# EAGLE design module_bga (EAGLE 9.3.0)

## Sheet 1 of 5
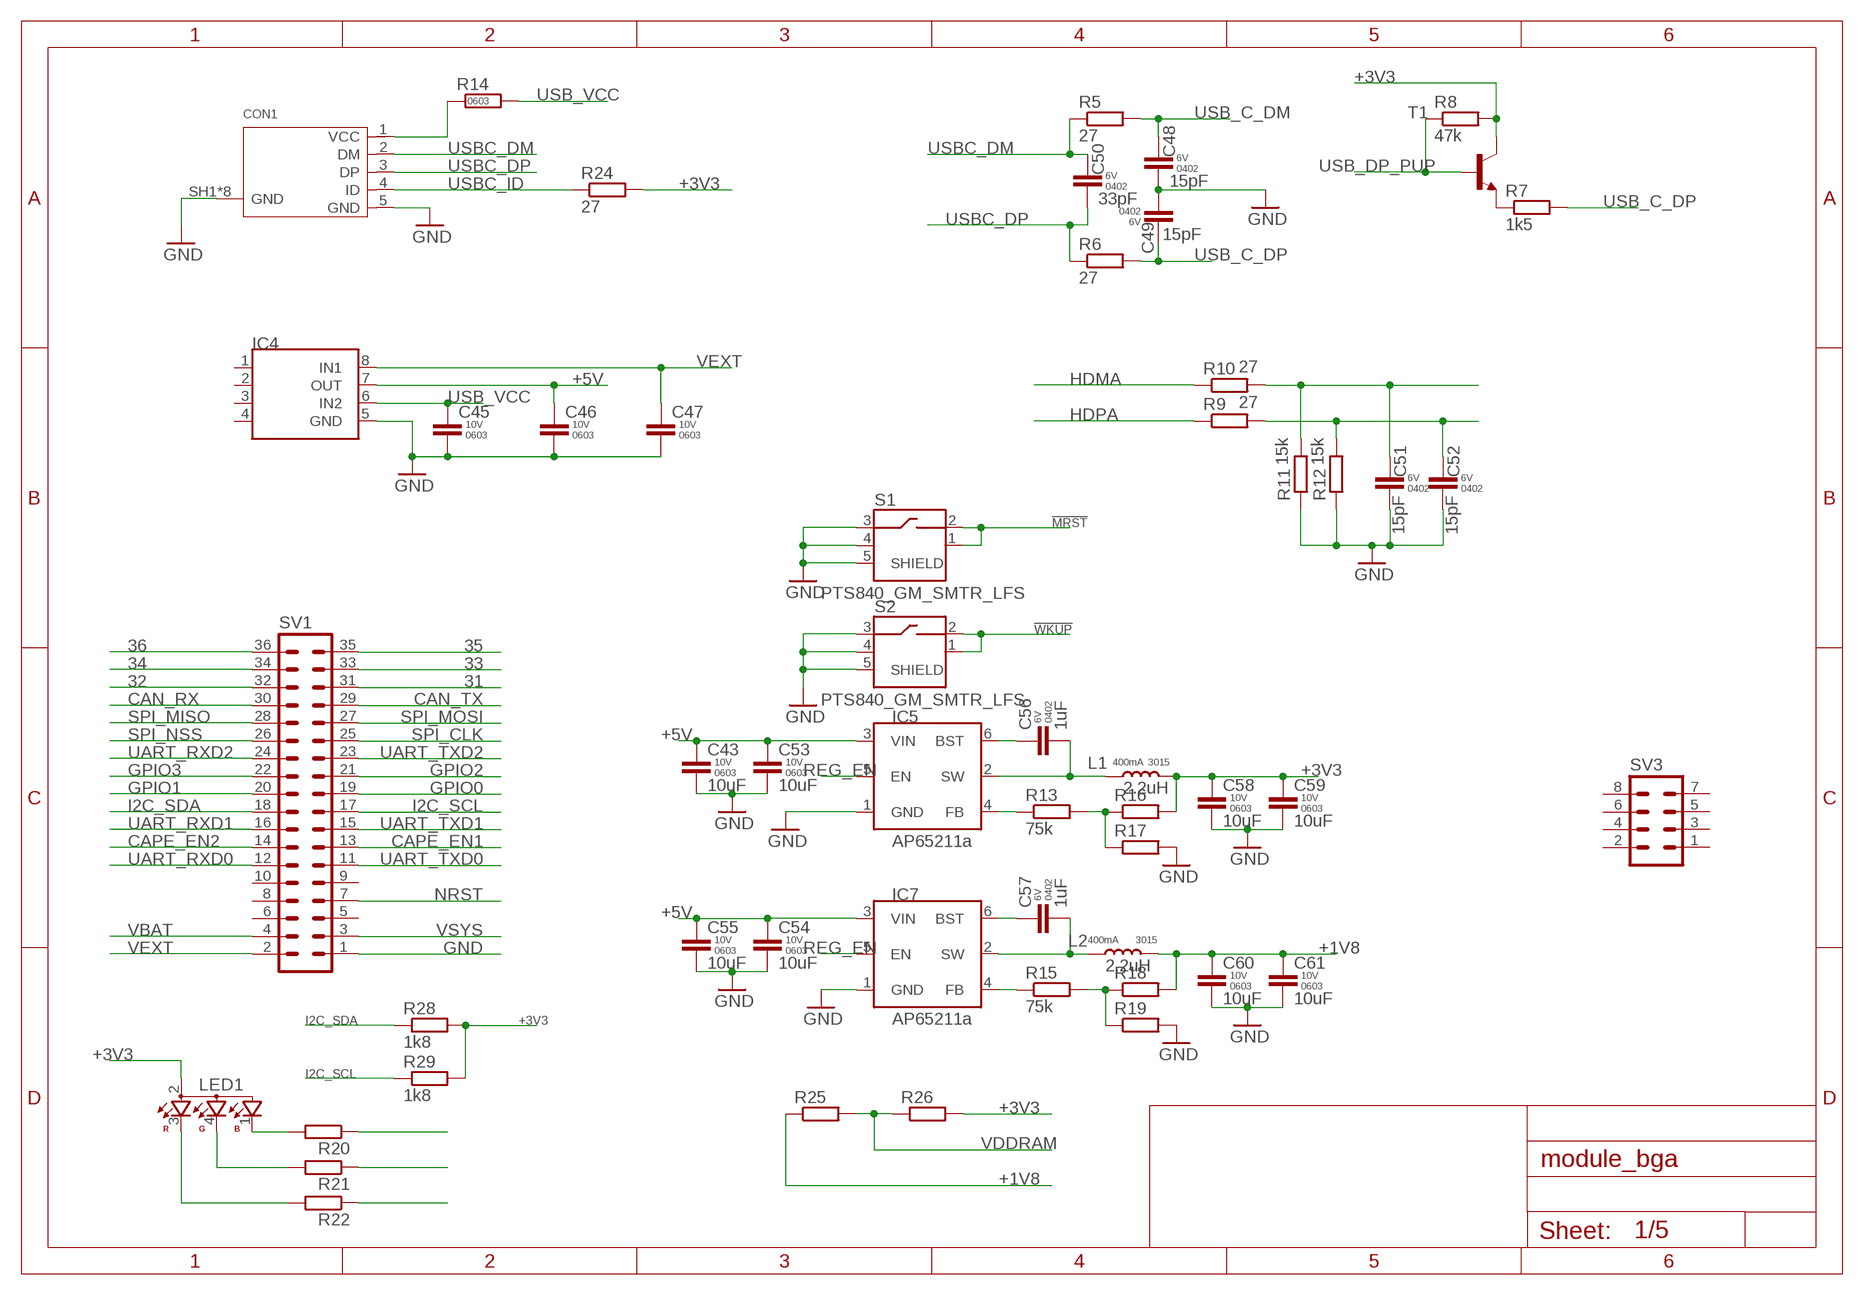
[diagram p0: schematic, sheet 1]

### Parts
C43  10uF  CAP-0603  [C0603]
C45  CAP-0603  [C0603]
C46  CAP-0603  [C0603]
C47  CAP-0603  [C0603]
C48  15pF  CAP-0402  [C0402K]
C49  15pF  CAP-0402  [C0402K]
C50  33pF  CAP-0402  [C0402K]
C51  15pF  CAP-0402  [C0402K]
C52  15pF  CAP-0402  [C0402K]
C53  10uF  CAP-0603  [C0603]
C54  10uF  CAP-0603  [C0603]
C55  10uF  CAP-0603  [C0603]
C56  1uF  CAP-0402  [C0402K]
C57  1uF  CAP-0402  [C0402K]
C58  10uF  CAP-0603  [C0603]
C59  10uF  CAP-0603  [C0603]
C60  10uF  CAP-0603  [C0603]
C61  10uF  CAP-0603  [C0603]
CON1  10118194-0001LF  [10118194]
IC4  TPS2115A  [TSSOP8]
IC5  AP65211  [SOT95P280X110-6]
IC7  AP65211  [SOT95P280X110-6]
L1  2.2uH  DJNR3015  [L3230M]
L2  2.2uH  DJNR3015  [L3230M]
LED1  OSTB1204C1E  [321015RGB]
R5  27  R-EU_R0402  [R0402]
R6  27  R-EU_R0402  [R0402]
R7  1k5  R-EU_R0402  [R0402]
R8  47k  R-EU_R0402  [R0402]
R9  27  R-EU_R0402  [R0402]
R10  27  R-EU_R0402  [R0402]
R11  15k  R-EU_R0402  [R0402]
R12  15k  R-EU_R0402  [R0402]
R13  75k  R-EU_R0402  [R0402]
R14  RES-0603  [R0603]
R15  75k  R-EU_R0402  [R0402]
R16  R-EU_R0402  [R0402]
R17  R-EU_R0402  [R0402]
R18  R-EU_R0402  [R0402]
R19  R-EU_R0402  [R0402]
R20  R-EU_R0402  [R0402]
R21  R-EU_R0402  [R0402]
R22  R-EU_R0402  [R0402]
R24  27  R-EU_R0402  [R0402]
R25  R-EU_R0603  [R0603]
R26  R-EU_R0603  [R0603]
R28  1k8  R-EU_R0402  [R0402]
R29  1k8  R-EU_R0402  [R0402]
S1  PTS840_GM_SMTR_LFS  [SW_PTS840GMSMTRLFS]
S2  PTS840_GM_SMTR_LFS  [SW_PTS840GMSMTRLFS]
SV1  MA18-2  [MA18-2]
SV3  MA04-2  [MA04-2]
T1  MMBT2222ALT1-NPN-SOT23-BEC  [SOT23-BEC]

### Nets
31: SV1.31
32: SV1.32
33: SV1.33
34: SV1.34
35: SV1.35
36: SV1.36
!MRST: S1.1 S1.2 ; also sheet 2
!WKUP: S2.1 S2.2 ; also sheet 2
+1V8: C60.1 C61.1 L2.2 R18.2 R25.1 ; also sheet 2
+3V3: C58.1 C59.1 L1.2 LED1.2 R8.2 R16.2 R24.2 R26.2 R28.2 R29.2 T1.C ; also sheet 2,5
+5V: C43.1 C46.1 C53.1 C54.1 C55.1 IC4.7(OUT) IC5.3(VIN) IC7.3(VIN)
CAN_RX: SV1.30
CAN_TX: SV1.29
CAPE_EN1: SV1.13
CAPE_EN2: SV1.14
GND: C43.2 C45.2 C46.2 C47.2 C48.2 C49.2 C51.2 C52.2 C53.2 C54.2 C55.2 C58.2 C59.2 C60.2 C61.2 CON1.5(GND) CON1.SH1(GND) CON1.SH2(GND) CON1.SH3(GND) CON1.SH4(GND) CON1.SH5(GND) CON1.SH6(GND) CON1.SH7(GND) CON1.SH8(GND) IC4.5(GND) IC5.1(GND) IC7.1(GND) R11.1 R12.1 R17.2 R19.2 S1.3 S1.4 S1.5(SHIELD) S2.3 S2.4 S2.5(SHIELD) SV1.1 ; also sheet 2,3,5
GPIO0: SV1.19
GPIO1: SV1.20
GPIO2: SV1.21
GPIO3: SV1.22
HDMA: R10.1 ; also sheet 2
HDPA: R9.1 ; also sheet 2
I2C_SCL: R29.1 SV1.17 ; also sheet 2
I2C_SDA: R28.1 SV1.18 ; also sheet 2
N$3: C56.2 IC5.2(SW) L1.1
N$4: CON1.1(VCC) R14.1
N$6: R20.1
N$8: C57.2 IC7.2(SW) L2.1
N$9: LED1.1 R20.2
N$10: C56.1 IC5.6(BST)
N$11: C57.1 IC7.6(BST)
N$13: C52.1 R9.2 R12.2
N$14: LED1.4 R21.2
N$15: IC7.4(FB) R15.1
N$18: R7.1 T1.E
N$19: C51.1 R10.2 R11.2
N$20: IC5.4(FB) R13.1
N$21: R15.2 R18.1 R19.1
N$22: R13.2 R16.1 R17.1
N$23: LED1.3 R22.2
N$24: R21.1
N$25: R22.1
NRST: SV1.7 ; also sheet 2
REG_EN: IC5.5(EN) IC7.5(EN)
SPI_CLK: SV1.25 ; also sheet 2
SPI_MISO: SV1.28 ; also sheet 2
SPI_MOSI: SV1.27 ; also sheet 2
SPI_NSS: SV1.26
UART_RXD0: SV1.12 ; also sheet 2
UART_RXD1: SV1.16 ; also sheet 2
UART_RXD2: SV1.24 ; also sheet 2
UART_TXD0: SV1.11 ; also sheet 2
UART_TXD1: SV1.15 ; also sheet 2
UART_TXD2: SV1.23 ; also sheet 2
USB_C_DM: C48.1 R5.2 ; also sheet 2
USB_C_DP: C49.1 R6.2 R7.2 ; also sheet 2
USB_DP_PUP: R8.1 T1.B
USB_VCC: C45.1 IC4.6(IN2) R14.2
USBC_DM: C50.1 CON1.2(DM) R5.1
USBC_DP: C50.2 CON1.3(DP) R6.1
USBC_ID: CON1.4(ID) R24.1
VBAT: SV1.4
VDDRAM: R25.2 R26.1 ; also sheet 2,3
VEXT: C47.1 IC4.8(IN1) SV1.2
VSYS: SV1.3
Unconnected: IC4.1 IC4.2 IC4.3 IC4.4 SV1.5 SV1.6 SV1.8 SV1.9 SV1.10 SV3.1 SV3.2 SV3.3 SV3.4 SV3.5 SV3.6 SV3.7 SV3.8

## Sheet 2 of 5
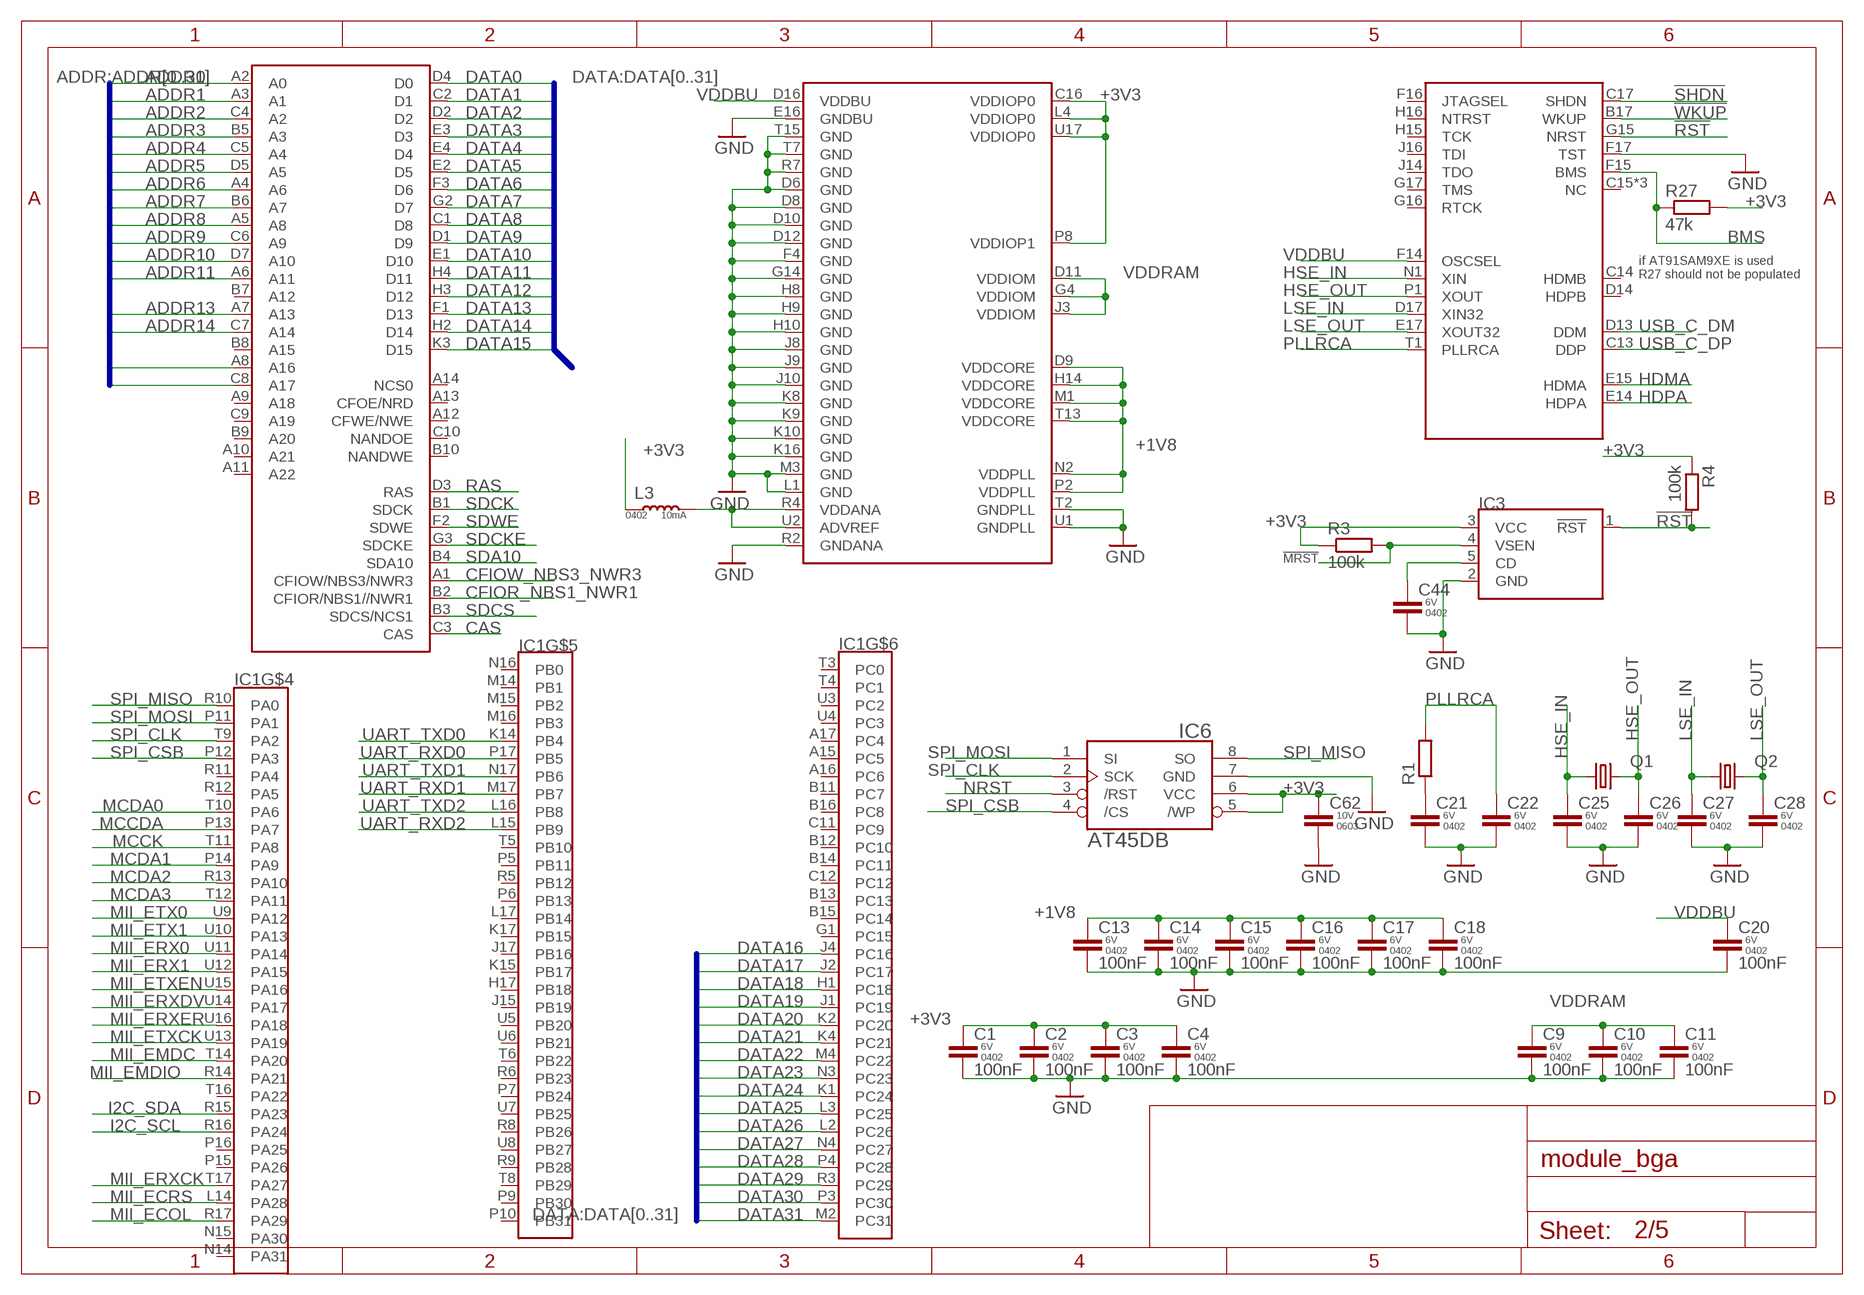
[diagram p1: schematic, sheet 2]

### Parts
C1  100nF  CAP-0402  [C0402K]
C2  100nF  CAP-0402  [C0402K]
C3  100nF  CAP-0402  [C0402K]
C4  100nF  CAP-0402  [C0402K]
C9  100nF  CAP-0402  [C0402K]
C10  100nF  CAP-0402  [C0402K]
C11  100nF  CAP-0402  [C0402K]
C13  100nF  CAP-0402  [C0402K]
C14  100nF  CAP-0402  [C0402K]
C15  100nF  CAP-0402  [C0402K]
C16  100nF  CAP-0402  [C0402K]
C17  100nF  CAP-0402  [C0402K]
C18  100nF  CAP-0402  [C0402K]
C20  100nF  CAP-0402  [C0402K]
C21  CAP-0402  [C0402K]
C22  CAP-0402  [C0402K]
C25  CAP-0402  [C0402K]
C26  CAP-0402  [C0402K]
C27  CAP-0402  [C0402K]
C28  CAP-0402  [C0402K]
C44  CAP-0402  [C0402K]
C62  CAP-0603  [C0603]
IC1  AT91SAM9260-BGA  [BGA289C80P17X17_1500X1500X100]
IC3  STM1831  [SOT95P280X100-5]
IC6  AT45DB-S  [SOIC8_208MIL]
L3  IND-0402  [L0402]
Q1  3215-7  [3215]
Q2  CFPX–217-NHT  [3215]
R1  R-EU_R0402  [R0402]
R3  100k  R-EU_R0402  [R0402]
R4  100k  R-EU_R0402  [R0402]
R27  47k  R-EU_R0402  [R0402]

### Nets
!MRST: IC3.4(VSEN) R3.2 ; also sheet 1
!RST: IC1.G15(NRST) IC3.1(!RST) R4.2
!SHDN: IC1.C17(SHDN)
!WKUP: IC1.B17(WKUP) ; also sheet 1
+1V8: C13.1 C14.1 C15.1 C16.1 C17.1 C18.1 IC1.D9(VDDCORE) IC1.H14(VDDCORE) IC1.M1(VDDCORE) IC1.N2(VDDPLL) IC1.P2(VDDPLL) IC1.T13(VDDCORE) ; also sheet 1
+3V3: C1.1 C2.1 C3.1 C4.1 C62.1 IC1.C16(VDDIOP0) IC1.L4(VDDIOP0) IC1.P8(VDDIOP1) IC1.U17(VDDIOP0) IC3.3(VCC) IC6.5(/WP) IC6.6(VCC) L3.1 R3.1 R4.1 R27.2 ; also sheet 1,5
ADDR0: IC1.A2(A0) ; also sheet 3
ADDR1: IC1.A3(A1) ; also sheet 3
ADDR2: IC1.C4(A2) ; also sheet 3
ADDR3: IC1.B5(A3) ; also sheet 3
ADDR4: IC1.C5(A4) ; also sheet 3
ADDR5: IC1.D5(A5) ; also sheet 3
ADDR6: IC1.A4(A6) ; also sheet 3
ADDR7: IC1.B6(A7) ; also sheet 3
ADDR8: IC1.A5(A8) ; also sheet 3
ADDR9: IC1.C6(A9) ; also sheet 3
ADDR10: IC1.D7(A10) ; also sheet 3
ADDR11: IC1.A6(A11) ; also sheet 3
ADDR13: IC1.A7(A13) ; also sheet 3
ADDR14: IC1.C7(A14) ; also sheet 3
ADDR16: IC1.A8(A16) ; also sheet 3
ADDR17: IC1.C8(A17) ; also sheet 3
BMS: IC1.F15(BMS) R27.1
CAS: IC1.C3(CAS) ; also sheet 3
CFIOR_NBS1_NWR1: IC1.B2(CFIOR/NBS1//NWR1) ; also sheet 3
CFIOW_NBS3_NWR3: IC1.A1(CFIOW/NBS3/NWR3) ; also sheet 3
DATA0: IC1.D4(D0) ; also sheet 3
DATA1: IC1.C2(D1) ; also sheet 3
DATA2: IC1.D2 ; also sheet 3
DATA3: IC1.E3(D3) ; also sheet 3
DATA4: IC1.E4(D4) ; also sheet 3
DATA5: IC1.E2(D5) ; also sheet 3
DATA6: IC1.F3(D6) ; also sheet 3
DATA7: IC1.G2(D7) ; also sheet 3
DATA8: IC1.C1(D8) ; also sheet 3
DATA9: IC1.D1(D9) ; also sheet 3
DATA10: IC1.E1(D10) ; also sheet 3
DATA11: IC1.H4(D11) ; also sheet 3
DATA12: IC1.H3(D12) ; also sheet 3
DATA13: IC1.F1(D13) ; also sheet 3
DATA14: IC1.H2(D14) ; also sheet 3
DATA15: IC1.K3(D15) ; also sheet 3
DATA16: IC1.J4(PC16) ; also sheet 3
DATA17: IC1.J2(PC17) ; also sheet 3
DATA18: IC1.H1(PC18) ; also sheet 3
DATA19: IC1.J1(PC19) ; also sheet 3
DATA20: IC1.K2(PC20) ; also sheet 3
DATA21: IC1.K4(PC21) ; also sheet 3
DATA22: IC1.M4(PC22) ; also sheet 3
DATA23: IC1.N3(PC23) ; also sheet 3
DATA24: IC1.K1(PC24) ; also sheet 3
DATA25: IC1.L3(PC25) ; also sheet 3
DATA26: IC1.L2(PC26) ; also sheet 3
DATA27: IC1.N4(PC27) ; also sheet 3
DATA28: IC1.P4(PC28) ; also sheet 3
DATA29: IC1.R3(PC29) ; also sheet 3
DATA30: IC1.P3(PC30) ; also sheet 3
DATA31: IC1.M2(PC31) ; also sheet 3
GND: C1.2 C2.2 C3.2 C4.2 C9.2 C10.2 C11.2 C13.2 C14.2 C15.2 C16.2 C17.2 C18.2 C20.2 C21.2 C22.2 C25.2 C26.2 C27.2 C28.2 C44.2 C62.2 IC1.D6(GND) IC1.D8(GND) IC1.D10(GND) IC1.D12(GND) IC1.E16(GNDBU) IC1.F4(GND) IC1.F17(TST) IC1.G14(GND) IC1.H8(GND) IC1.H9(GND) IC1.H10(GND) IC1.J8(GND) IC1.J9(GND) IC1.J10(GND) IC1.K8(GND) IC1.K9(GND) IC1.K10(GND) IC1.K16(GND) IC1.L1(GND) IC1.M3(GND) IC1.R2(GNDANA) IC1.R7(GND) IC1.T2(GNDPLL) IC1.T7(GND) IC1.T15(GND) IC1.U1(GNDPLL) IC3.2(GND) IC6.7(GND) ; also sheet 1,3,5
HDMA: IC1.E15(HDMA) ; also sheet 1
HDPA: IC1.E14(HDPA) ; also sheet 1
HSE_IN: C25.1 IC1.N1(XIN) Q1.1
HSE_OUT: C26.1 IC1.P1(XOUT) Q1.3
I2C_SCL: IC1.R16(PA24) ; also sheet 1
I2C_SDA: IC1.R15(PA23) ; also sheet 1
LSE_IN: C27.1 IC1.D17(XIN32) Q2.1
LSE_OUT: C28.1 IC1.E17(XOUT32) Q2.2
MCCDA: IC1.P13(PA7) ; also sheet 5
MCCK: IC1.T11(PA8) ; also sheet 5
MCDA0: IC1.T10(PA6) ; also sheet 5
MCDA1: IC1.P14(PA9) ; also sheet 5
MCDA2: IC1.R13(PA10) ; also sheet 5
MCDA3: IC1.T12(PA11) ; also sheet 5
MII_ECOL: IC1.R17(PA29)
MII_ECRS: IC1.L14(PA28)
MII_EMDC: IC1.T14(PA20)
MII_EMDIO: IC1.R14(PA21)
MII_ERX0: IC1.U11(PA14)
MII_ERX1: IC1.U12(PA15)
MII_ERXCK: IC1.T17(PA27)
MII_ERXDV: IC1.U14(PA17)
MII_ERXER: IC1.U16(PA18)
MII_ETX0: IC1.U9(PA12)
MII_ETX1: IC1.U10(PA13)
MII_ETXCK: IC1.U13(PA19)
MII_ETXEN: IC1.U15(PA16)
N$1: C21.1 R1.1
N$17: C44.1 IC3.5(CD)
N$28: IC1.R4(VDDANA) IC1.U2(ADVREF) L3.2
NRST: IC6.3(/RST) ; also sheet 1
PLLRCA: C22.1 IC1.T1(PLLRCA) R1.2
RAS: IC1.D3(RAS) ; also sheet 3
SDA10: IC1.B4(SDA10) ; also sheet 3
SDCK: IC1.B1(SDCK) ; also sheet 3
SDCKE: IC1.G3(SDCKE) ; also sheet 3
SDCS: IC1.B3(SDCS/NCS1) ; also sheet 3
SDWE: IC1.F2(SDWE) ; also sheet 3
SPI_CLK: IC1.T9(PA2) IC6.2(SCK) ; also sheet 1
SPI_CSB: IC1.P12(PA3) IC6.4(/CS)
SPI_MISO: IC1.R10(PA0) IC6.8(SO) ; also sheet 1
SPI_MOSI: IC1.P11(PA1) IC6.1(SI) ; also sheet 1
UART_RXD0: IC1.P17(PB5) ; also sheet 1
UART_RXD1: IC1.M17(PB7) ; also sheet 1
UART_RXD2: IC1.L15(PB9) ; also sheet 1
UART_TXD0: IC1.K14(PB4) ; also sheet 1
UART_TXD1: IC1.N17(PB6) ; also sheet 1
UART_TXD2: IC1.L16(PB8) ; also sheet 1
USB_C_DM: IC1.D13(DDM) ; also sheet 1
USB_C_DP: IC1.C13(DDP) ; also sheet 1
VDDBU: C20.1 IC1.D16(VDDBU) IC1.F14(OSCSEL)
VDDRAM: C9.1 C10.1 C11.1 IC1.D11(VDDIOM) IC1.G4(VDDIOM) IC1.J3(VDDIOM) ; also sheet 1,3
Unconnected: IC1.A9(A18) IC1.A10(A21) IC1.A11(A22) IC1.A12(CFWE/NWE) IC1.A13(CFOE/NRD) IC1.A14(NCS0) IC1.A15(PC5) IC1.A16(PC6) IC1.A17(PC4) IC1.B7(A12) IC1.B8(A15) IC1.B9(A20) IC1.B10(NANDWE) IC1.B11(PC7) IC1.B12(PC10) IC1.B13(PC13) IC1.B14(PC11) IC1.B15(PC14) IC1.B16(PC8) IC1.C9(A19) IC1.C10(NANDOE) IC1.C11(PC9) IC1.C12 IC1.C14(HDMB) IC1.C15(NC) IC1.D14(HDPB) IC1.D15(NC) IC1.F16(JTAGSEL) IC1.G1(PC15) IC1.G16(RTCK) IC1.G17(TMS) IC1.H15(TCK) IC1.H16(NTRST) IC1.H17(PB18) IC1.J14(TDO) IC1.J15(PB19) IC1.J16(TDI) IC1.J17(PB16) IC1.K15(PB17) IC1.K17(PB15) IC1.L17(PB14) IC1.M14(PB1) IC1.M15(PB2) IC1.M16(PB3) IC1.N14(PA31) IC1.N15(PA30) IC1.N16(PB0) IC1.P5(PB11) IC1.P6(PB13) IC1.P7(PB24) IC1.P9(PB30) IC1.P10(PB31) IC1.P15(PA26) IC1.P16(PA25) IC1.R1(NC) IC1.R5(PB12) IC1.R6(PB23) IC1.R8(PB26) IC1.R9(PB28) IC1.R11(PA4) IC1.R12(PA5) IC1.T3(PC0) IC1.T4(PC1) IC1.T5(PB10) IC1.T6(PB22) IC1.T8(PB29) IC1.T16(PA22) IC1.U3(PC2) IC1.U4(PC3) IC1.U5(PB20) IC1.U6(PB21) IC1.U7(PB25) IC1.U8(PB27)

### Buses
ADDR:ADDR[0..31]
DATA:DATA[0..31]

### Notes on the sheet
- if AT91SAM9XE is used 
  R27 should not be populated

## Sheet 3 of 5: SDRAM
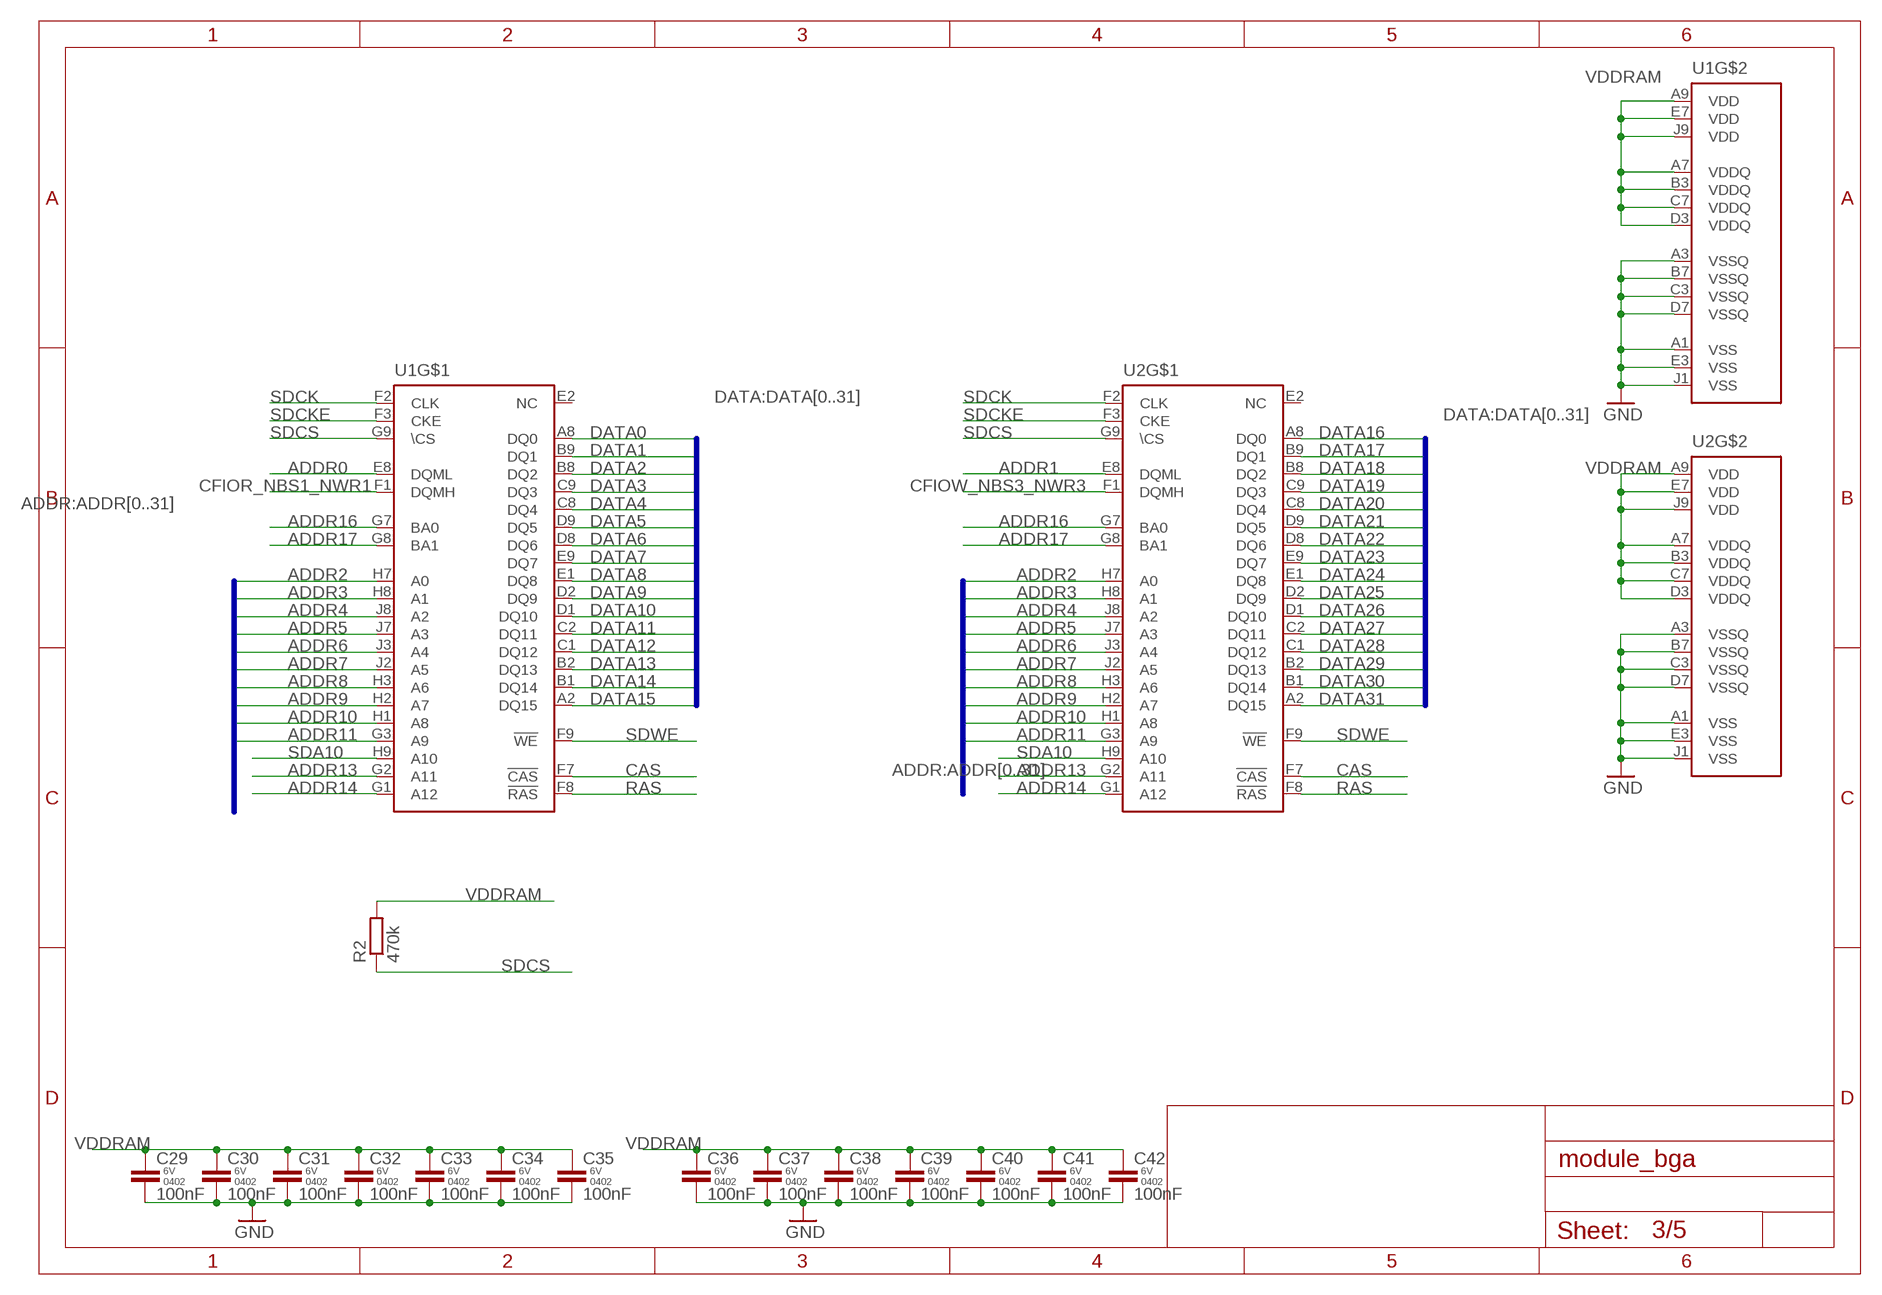
[diagram p2: schematic, sheet 3]

### Parts
C29  100nF  CAP-0402  [C0402K]
C30  100nF  CAP-0402  [C0402K]
C31  100nF  CAP-0402  [C0402K]
C32  100nF  CAP-0402  [C0402K]
C33  100nF  CAP-0402  [C0402K]
C34  100nF  CAP-0402  [C0402K]
C35  100nF  CAP-0402  [C0402K]
C36  100nF  CAP-0402  [C0402K]
C37  100nF  CAP-0402  [C0402K]
C38  100nF  CAP-0402  [C0402K]
C39  100nF  CAP-0402  [C0402K]
C40  100nF  CAP-0402  [C0402K]
C41  100nF  CAP-0402  [C0402K]
C42  100nF  CAP-0402  [C0402K]
R2  470k  R-EU_R0402  [R0402]
U1  IS42S16160G  [BGA81C80P9X9_800X800X120]
U2  IS42S16160G  [BGA81C80P9X9_800X800X120]

### Nets
ADDR0: U1.E8(DQML) ; also sheet 2
ADDR1: U2.E8(DQML) ; also sheet 2
ADDR2: U1.H7(A0) U2.H7(A0) ; also sheet 2
ADDR3: U1.H8(A1) U2.H8(A1) ; also sheet 2
ADDR4: U1.J8(A2) U2.J8(A2) ; also sheet 2
ADDR5: U1.J7(A3) U2.J7(A3) ; also sheet 2
ADDR6: U1.J3(A4) U2.J3(A4) ; also sheet 2
ADDR7: U1.J2(A5) U2.J2(A5) ; also sheet 2
ADDR8: U1.H3(A6) U2.H3(A6) ; also sheet 2
ADDR9: U1.H2(A7) U2.H2(A7) ; also sheet 2
ADDR10: U1.H1(A8) U2.H1(A8) ; also sheet 2
ADDR11: U1.G3(A9) U2.G3(A9) ; also sheet 2
ADDR13: U1.G2(A11) U2.G2(A11) ; also sheet 2
ADDR14: U1.G1(A12) U2.G1(A12) ; also sheet 2
ADDR16: U1.G7(BA0) U2.G7(BA0) ; also sheet 2
ADDR17: U1.G8(BA1) U2.G8(BA1) ; also sheet 2
CAS: U1.F7(!CAS) U2.F7(!CAS) ; also sheet 2
CFIOR_NBS1_NWR1: U1.F1(DQMH) ; also sheet 2
CFIOW_NBS3_NWR3: U2.F1(DQMH) ; also sheet 2
DATA0: U1.A8(DQ0) ; also sheet 2
DATA1: U1.B9(DQ1) ; also sheet 2
DATA2: U1.B8(DQ2) ; also sheet 2
DATA3: U1.C9(DQ3) ; also sheet 2
DATA4: U1.C8(DQ4) ; also sheet 2
DATA5: U1.D9(DQ5) ; also sheet 2
DATA6: U1.D8(DQ6) ; also sheet 2
DATA7: U1.E9(DQ7) ; also sheet 2
DATA8: U1.E1(DQ8) ; also sheet 2
DATA9: U1.D2(DQ9) ; also sheet 2
DATA10: U1.D1(DQ10) ; also sheet 2
DATA11: U1.C2(DQ11) ; also sheet 2
DATA12: U1.C1(DQ12) ; also sheet 2
DATA13: U1.B2(DQ13) ; also sheet 2
DATA14: U1.B1(DQ14) ; also sheet 2
DATA15: U1.A2(DQ15) ; also sheet 2
DATA16: U2.A8(DQ0) ; also sheet 2
DATA17: U2.B9(DQ1) ; also sheet 2
DATA18: U2.B8(DQ2) ; also sheet 2
DATA19: U2.C9(DQ3) ; also sheet 2
DATA20: U2.C8(DQ4) ; also sheet 2
DATA21: U2.D9(DQ5) ; also sheet 2
DATA22: U2.D8(DQ6) ; also sheet 2
DATA23: U2.E9(DQ7) ; also sheet 2
DATA24: U2.E1(DQ8) ; also sheet 2
DATA25: U2.D2(DQ9) ; also sheet 2
DATA26: U2.D1(DQ10) ; also sheet 2
DATA27: U2.C2(DQ11) ; also sheet 2
DATA28: U2.C1(DQ12) ; also sheet 2
DATA29: U2.B2(DQ13) ; also sheet 2
DATA30: U2.B1(DQ14) ; also sheet 2
DATA31: U2.A2(DQ15) ; also sheet 2
GND: C29.2 C30.2 C31.2 C32.2 C33.2 C34.2 C35.2 C36.2 C37.2 C38.2 C39.2 C40.2 C41.2 C42.2 U1.A1(VSS) U1.A3(VSSQ) U1.B7(VSSQ) U1.C3(VSSQ) U1.D7(VSSQ) U1.E3(VSS) U1.J1(VSS) U2.A1(VSS) U2.A3(VSSQ) U2.B7(VSSQ) U2.C3(VSSQ) U2.D7(VSSQ) U2.E3(VSS) U2.J1(VSS) ; also sheet 1,2,5
RAS: U1.F8(!RAS) U2.F8(!RAS) ; also sheet 2
SDA10: U1.H9(A10) U2.H9(A10) ; also sheet 2
SDCK: U1.F2(CLK) U2.F2(CLK) ; also sheet 2
SDCKE: U1.F3(CKE) U2.F3(CKE) ; also sheet 2
SDCS: R2.1 U1.G9(\CS) U2.G9(\CS) ; also sheet 2
SDWE: U1.F9(!WE) U2.F9(!WE) ; also sheet 2
VDDRAM: C29.1 C30.1 C31.1 C32.1 C33.1 C34.1 C35.1 C36.1 C37.1 C38.1 C39.1 C40.1 C41.1 C42.1 R2.2 U1.A7(VDDQ) U1.A9(VDD) U1.B3(VDDQ) U1.C7(VDDQ) U1.D3(VDDQ) U1.E7(VDD) U1.J9(VDD) U2.A7(VDDQ) U2.A9(VDD) U2.B3(VDDQ) U2.C7(VDDQ) U2.D3(VDDQ) U2.E7(VDD) U2.J9(VDD) ; also sheet 1,2
Unconnected: U1.E2(NC) U2.E2(NC)

### Buses
DATA:DATA[0..31]
ADDR:ADDR[0..31]

## Sheet 4 of 5: Ethernet
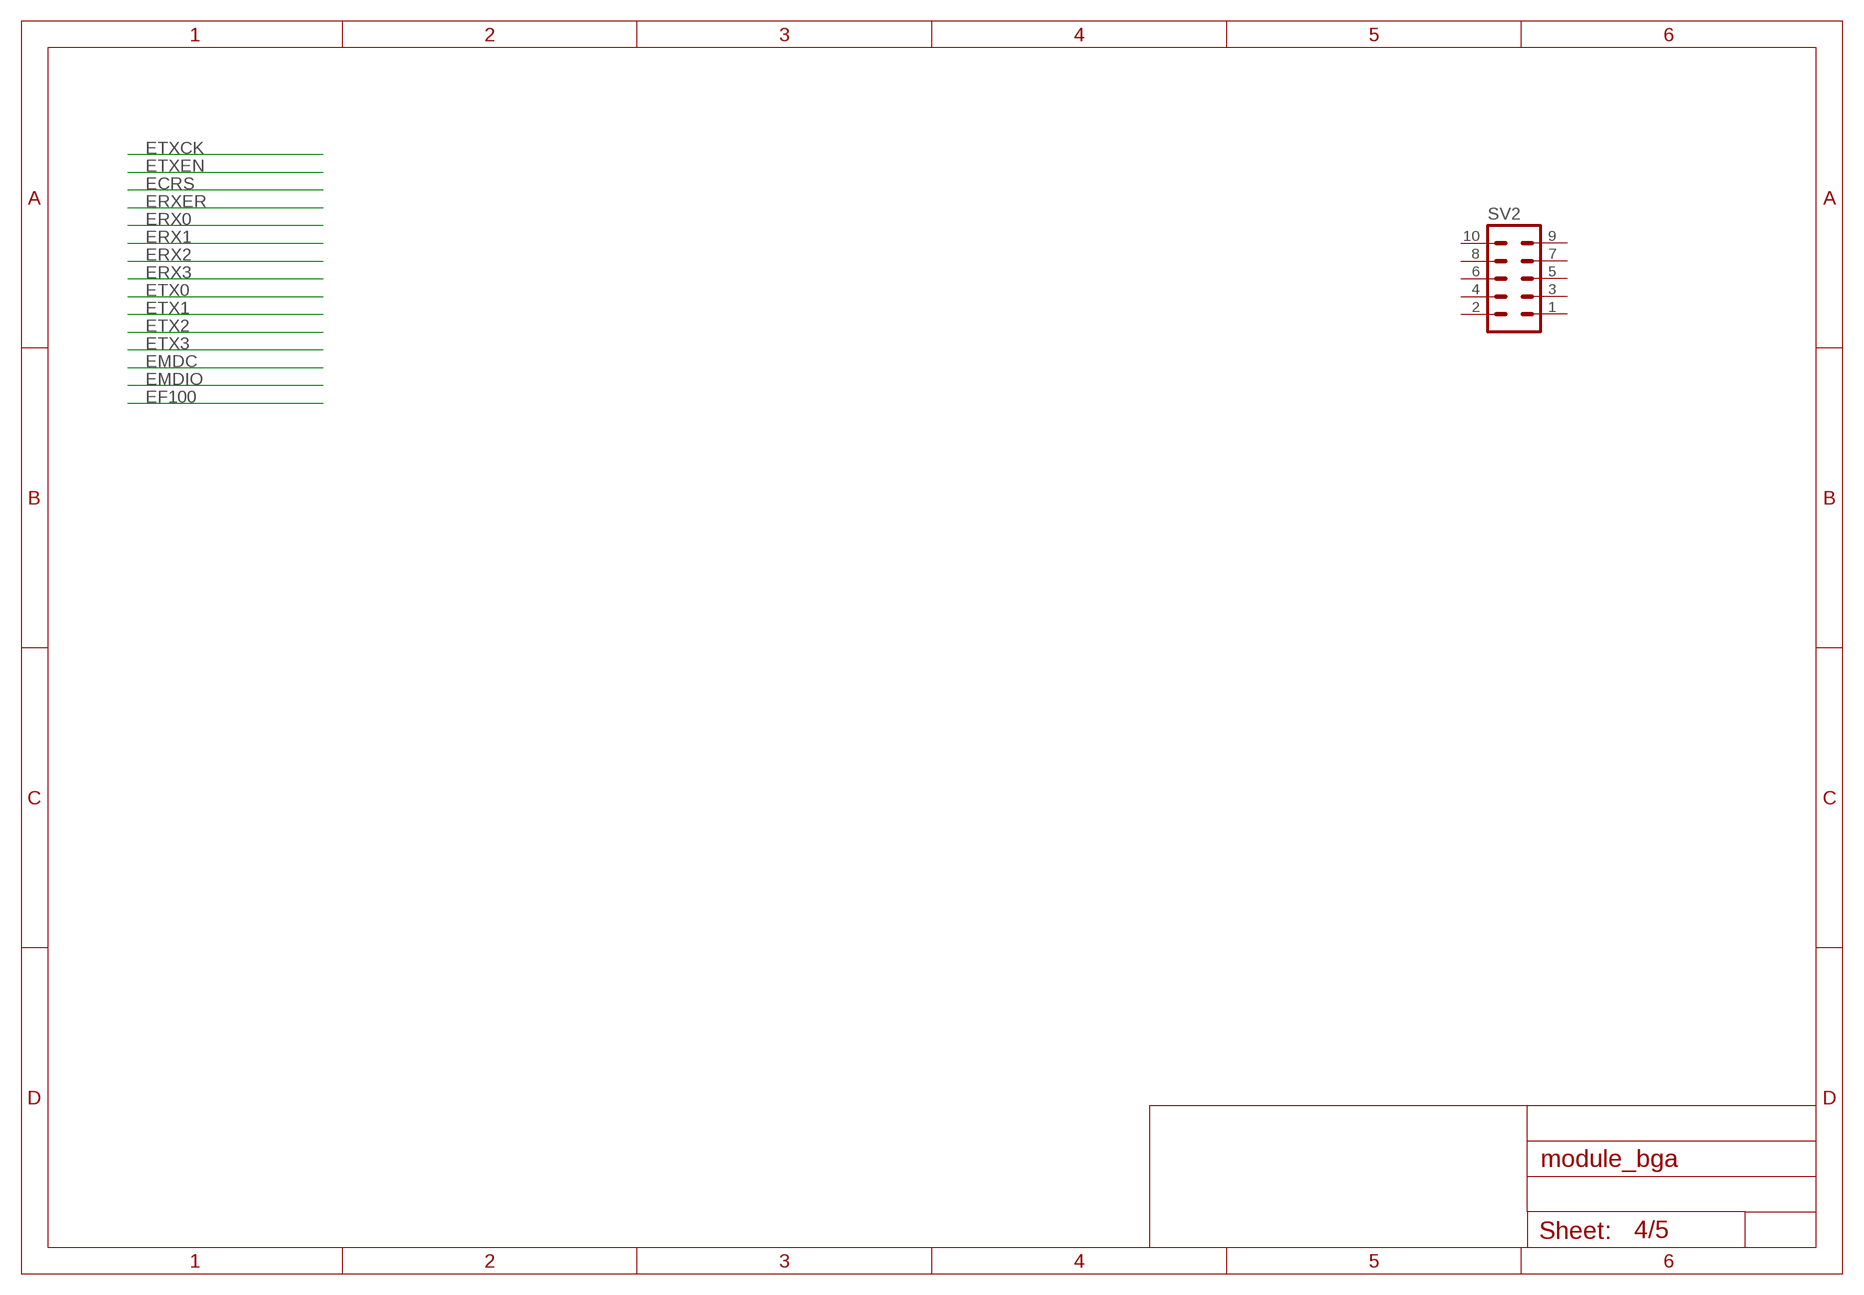
[diagram p3: schematic, sheet 4]

### Parts
SV2  MA05-2  [MA05-2]
Unconnected: SV2.1 SV2.2 SV2.3 SV2.4 SV2.5 SV2.6 SV2.7 SV2.8 SV2.9 SV2.10

## Sheet 5 of 5: SD Card
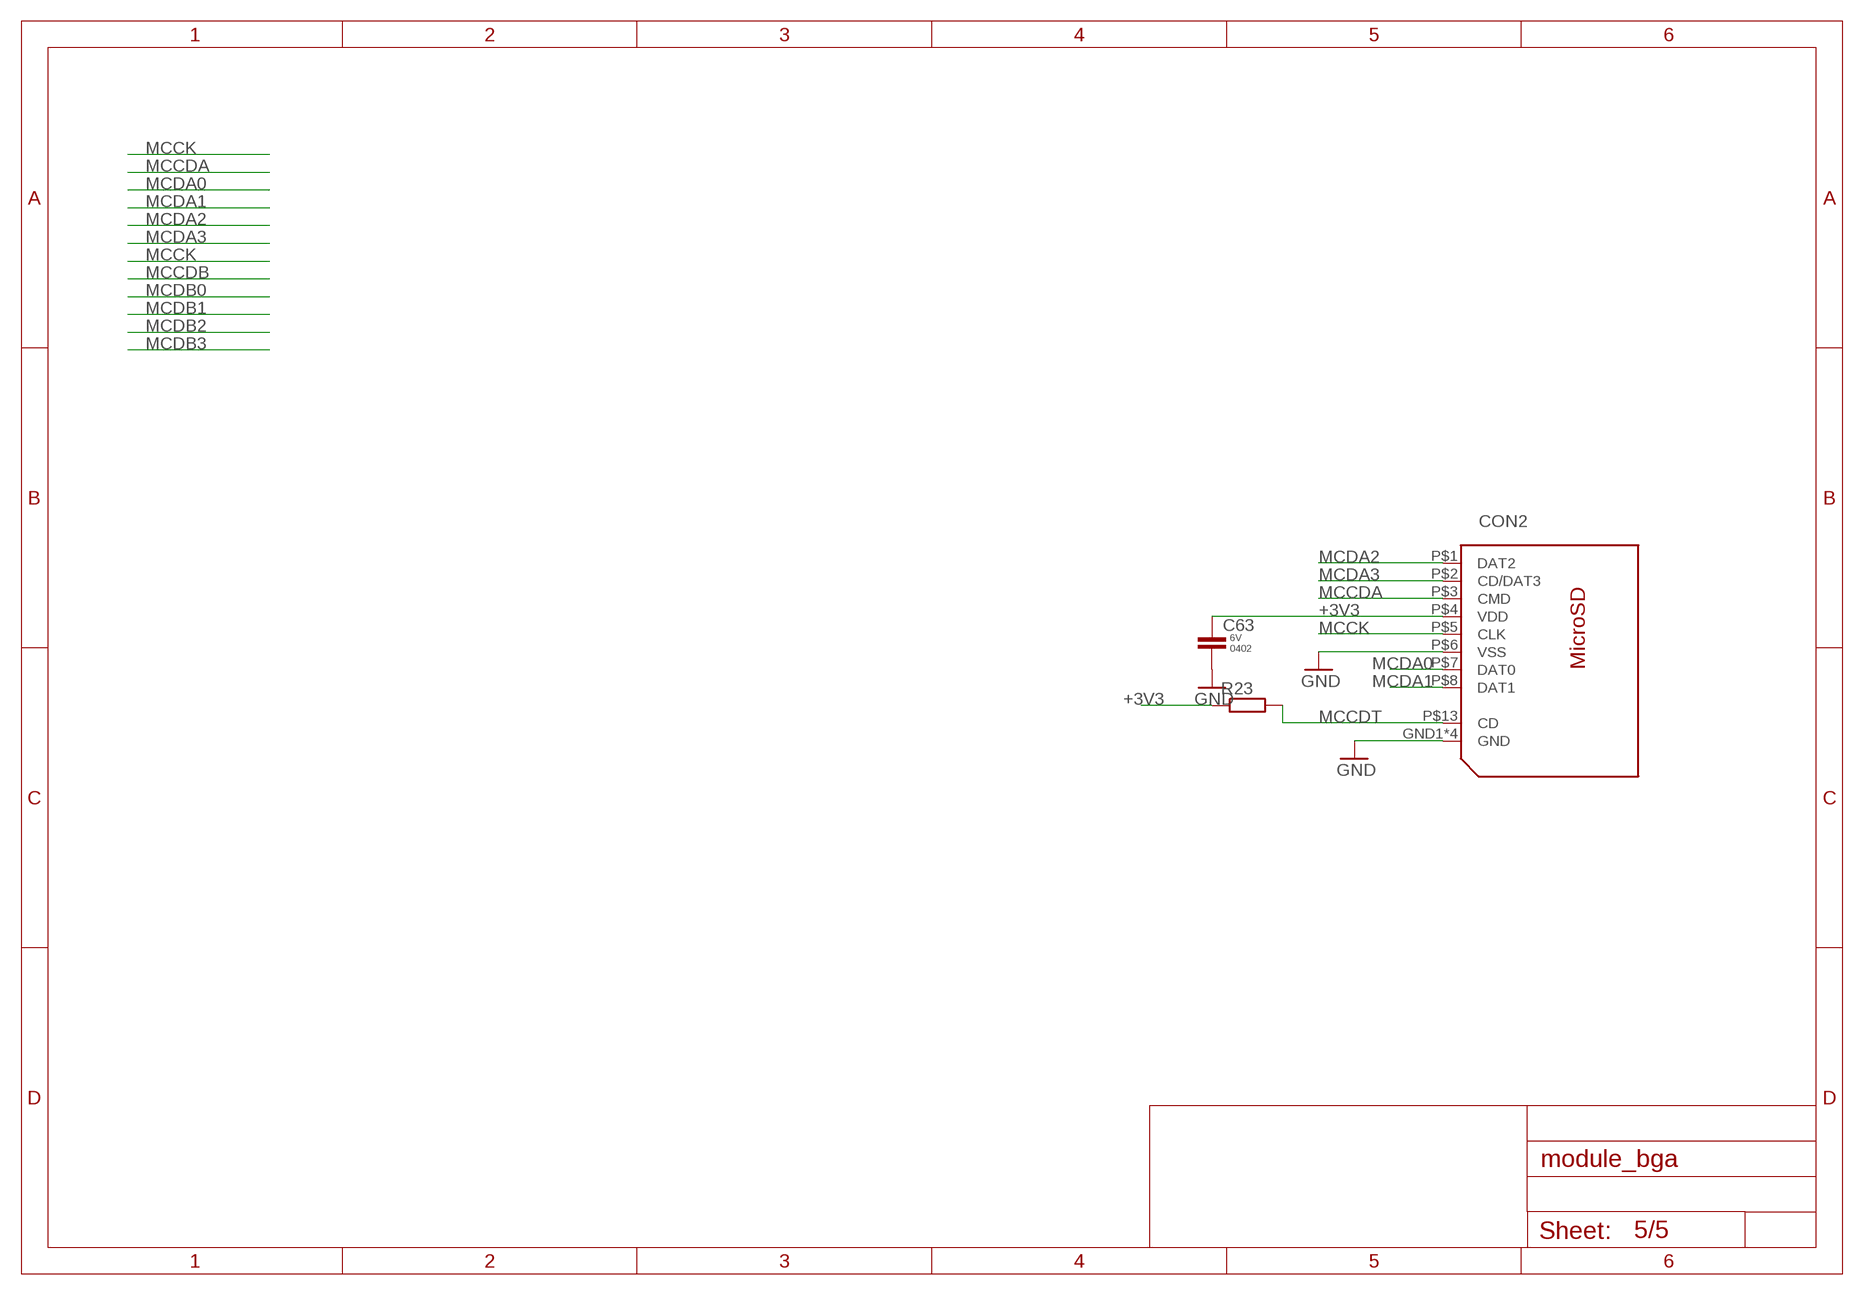
[diagram p4: schematic, sheet 5]

### Parts
C63  CAP-0402  [C0402K]
CON2  112J-TXAR  [112J]
R23  R-EU_R0402  [R0402]

### Nets
+3V3: C63.1 CON2.P$4(VDD) R23.1 ; also sheet 1,2
GND: C63.2 CON2.GND1(GND) CON2.GND2(GND) CON2.GND3(GND) CON2.GND4(GND) CON2.P$6(VSS) ; also sheet 1,2,3
MCCDA: CON2.P$3(CMD) ; also sheet 2
MCCDT: CON2.P$13(CD) R23.2
MCCK: CON2.P$5(CLK) ; also sheet 2
MCDA0: CON2.P$7(DAT0) ; also sheet 2
MCDA1: CON2.P$8(DAT1) ; also sheet 2
MCDA2: CON2.P$1(DAT2) ; also sheet 2
MCDA3: CON2.P$2(CD/DAT3) ; also sheet 2

## Library data of the parts
C1-C4 C9-C11 C13-C18 C20-C22 C25-C42 C44 C48-C52 C56 C57 C63 = parts-passives:CAP-; PACKAGE: 0402; RATING: 6V
C43 C45-C47 C53-C55 C58-C62 = parts-passives:CAP-; PACKAGE: 0603; RATING: 10V
CON1 = parts-amphenol:10118194-00
CON2 = parts-attend:112J-TXAR
IC1 = parts-microchip:AT91SAM9260-BGA
IC3 = parts-st:STM1831: The STM1831 is a voltage detector with very low current consumption. It monitors a voltage on a separate input pin (VSEN), which is fully functional even if the monitored voltage goes down to 0 V. In addition, the delay of the output can be adjusted by an external capacitor
IC4 = parts-ti:TPS211
IC5 IC7 = parts-diodes:AP65211
IC6 = parts-adesto:AT45DB
L1 L2 = parts-ferrocore:DJNR3015; CURRENT: 400mA; PACKAGE: 3015
L3 = parts-passives:IND-; CURRENT: 10mA; PACKAGE: 0402
LED1 = parts-optosupply:OSTB1204
Q1 = parts-srpassives:3215: SMD Crystal 3.2x2.5
Q2 = parts-iqd:CFPX–217: 32.768
R1-R13 R15-R29 = rcl:R-EU_: RESISTOR, European symbol; SPICEPREFIX: R
R14 = parts-passives:RES-; PACKAGE: 0603
S1 S2 = parts_ck:PTS840_GM_SMTR_LFS: Switch Tactile N.O. SPST Button Gull Wing 0.05A 12VDC 100000Cycle 1.57N SMD T/R; AVAILABILITY: Unavailable; DESCRIPTION: Switch Tactile N.O. SPST Button Gull Wing 0.05A 12VDC 100000Cycle 1.57N SMD T/R; MF: C&K; MP: PTS840 GM SMTR LFS; PACKAGE: None; PRICE: None
SV1 = con-lstb:MA18-2: PIN HEADER; OC_FARNELL: unknown; OC_NEWARK: unknown
SV2 = con-lstb:MA05-2: PIN HEADER; OC_FARNELL: unknown; OC_NEWARK: unknown
SV3 = con-lstb:MA04-2: PIN HEADER; OC_FARNELL: unknown; OC_NEWARK: unknown
T1 = transistor:*-NPN-: NPN Transistror BF959 corrected 2008.03.06
U1 U2 = parts-issi:IS42S16160G

## Board
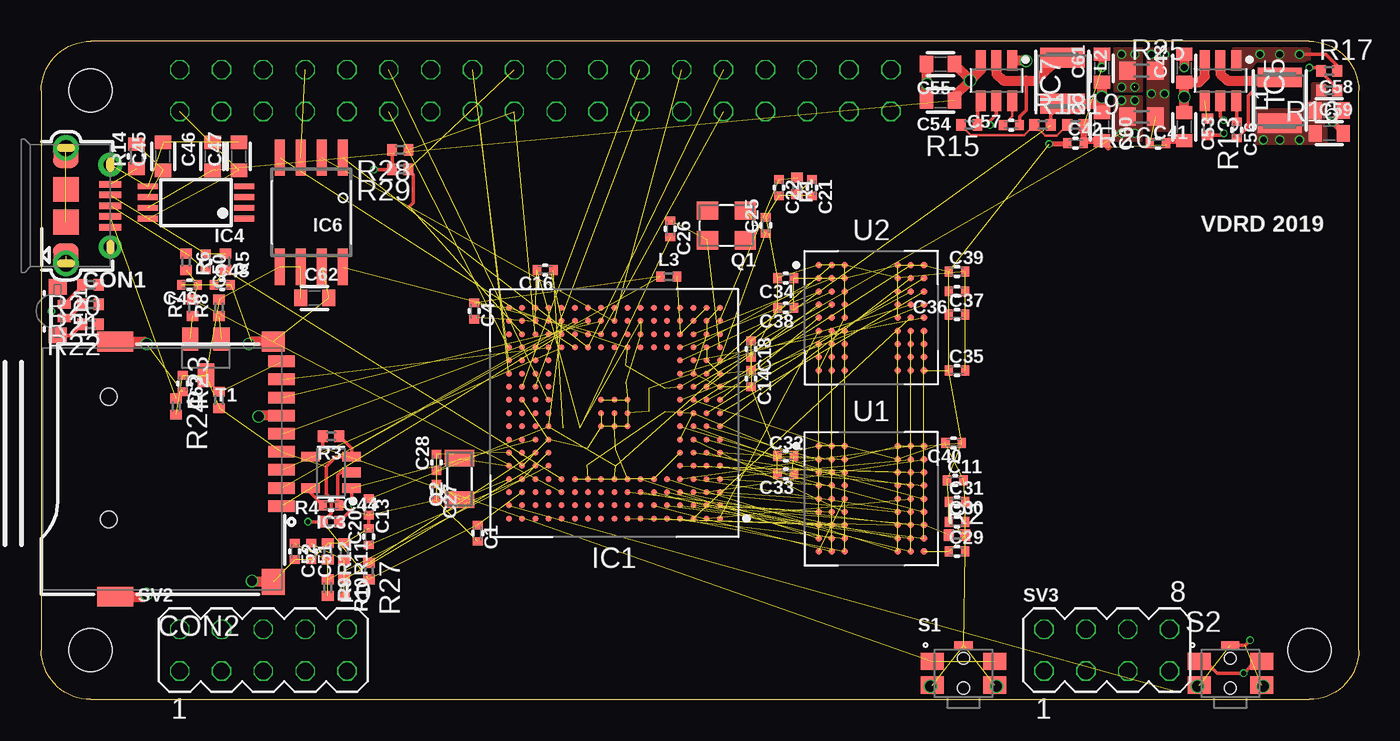
[diagram p5: board, top side]
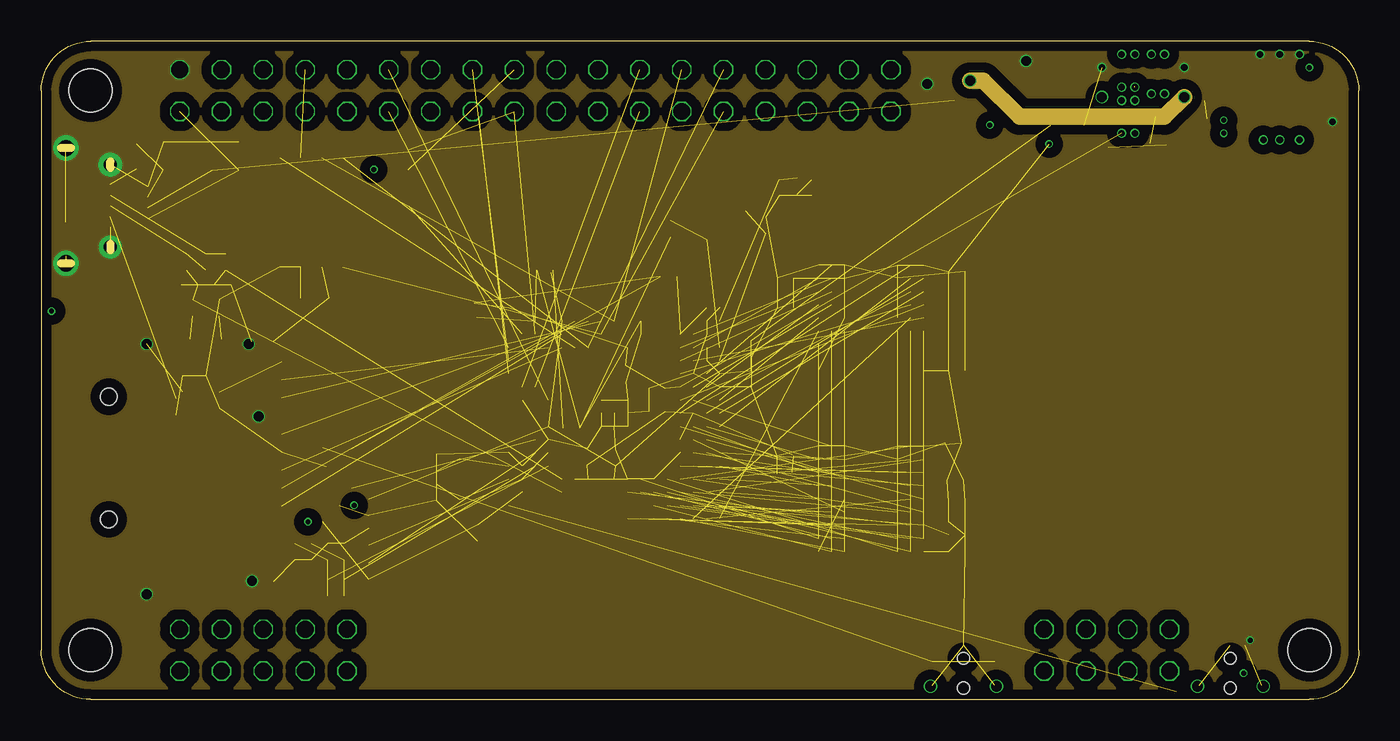
[diagram p6: board, inner layer Route2]
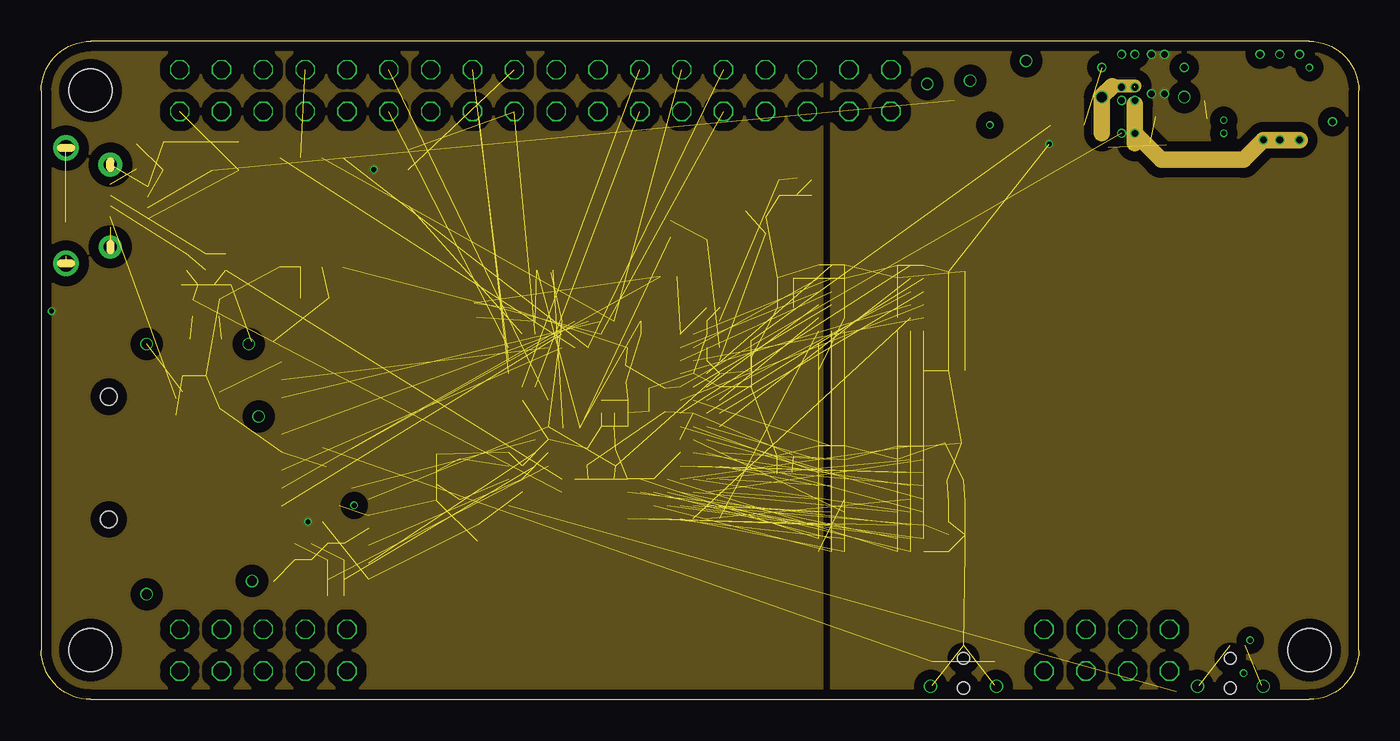
[diagram p7: board, inner layer Route15]
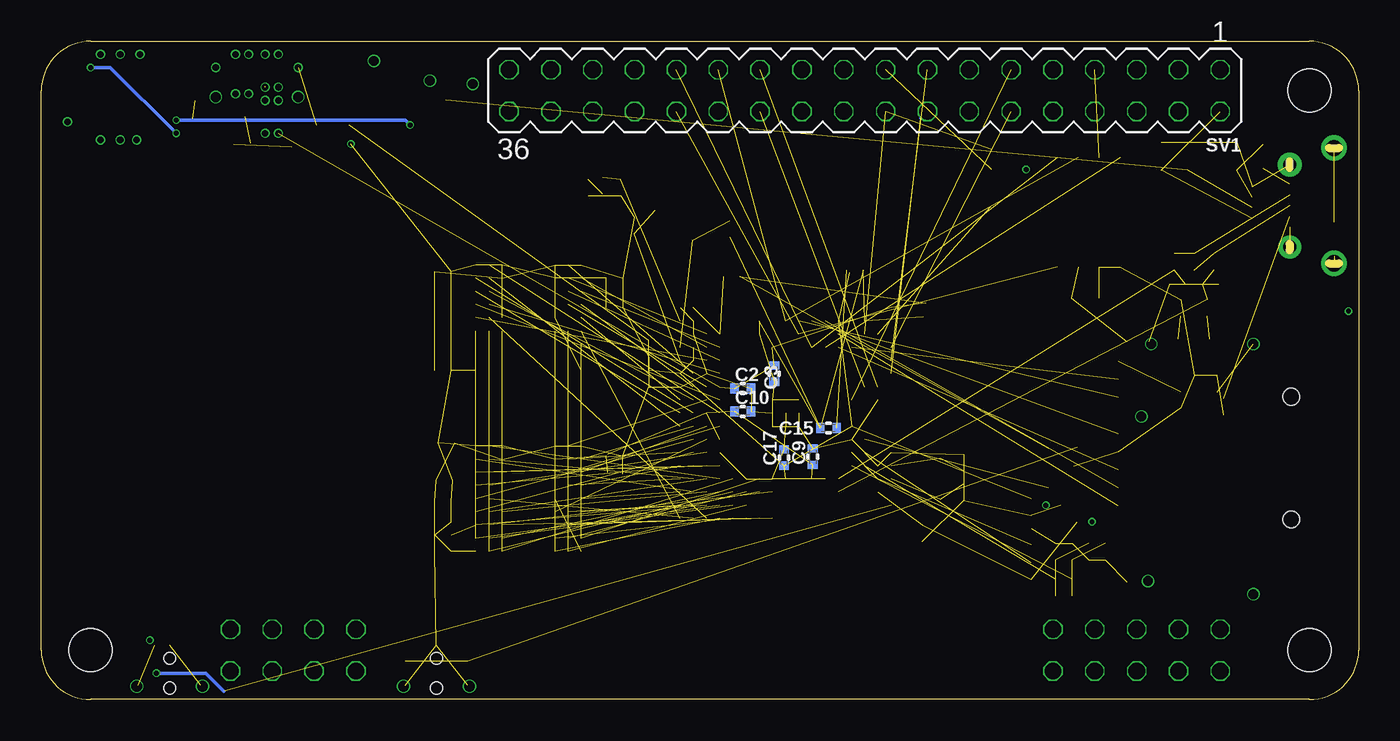
[diagram p8: board, bottom side, seen from below]

Size 80 x 40 mm. Coordinates in mm from the lower left corner, seen from the top.
Outline: 3,0 77,0 arc90 80,3 80,37 arc90 77,40 3,40 arc90 0,37 0,3 arc90 3,0
Copper layers (1+2*15+16): Top 0.035mm / dielectric 0.2mm / Route2 0.035mm / dielectric 0.8mm / Route15 0.035mm / dielectric 0.2mm / Bottom 0.035mm
Design rules "default *": minimum track width 4mil, minimum drill 0.2mm, track to track 4mil, track to pad 4mil, pad to pad 4mil, via to via 4mil, smd to smd 4mil, copper to edge 0.4mm, drill to drill 6mil, minimum pad ring 3mil, minimum via ring 3mil, stop-mask expansion 0.1mm, vias tented up to drill 0.3mm, thermal gap 10mil
Holes 2.6 mm at 3,37 3,3 77,3
tRestrict: area 0,34 to 6,40; area 0,0 to 6,6; area 74,0 to 80,6
bRestrict: area 0,34 to 6,40; area 0,0 to 6,6; area 74,0 to 80,6

### Footprints (pad centres in the part's own frame; a part is rotated, then mirrored left to right if it is on the bottom)
C0402K = smd 0.5 x 0.6: 1 -0.5,0; 2 0.5,0
C0603 = smd 0.8 x 1: 1 -0.85,0; 2 0.85,0
10118194 = smd 0.4 x 1.35: 1 -1.3,2.7; 2 -0.65,2.7; 3 0,2.7; 4 0.65,2.7; 5 1.3,2.7 | drill 0.8 pad 1.45: SH1 -2.5,2.7 | drill 0.8 pad 1.4: SH2 2.5,2.7 | drill 1 pad 1.55: SH3 -3.5,0; SH8 3.5,0 | smd 1.5 x 1.55: SH4 -3.05,0; SH5 -1,0; SH6 1,0; SH7 3.05,0
112J = smd 1.2 x 1.4: GND1 -7.75,-0.5 | smd 1.2 x 2.2: GND2 -7.75,-10.1; GND3 7.75,-10.1 | smd 1.6 x 1.4: GND4 6.85,-0.5 | smd 0.7 x 1.6: P$1 2.25,0; P$2 1.15,0; P$3 0.05,0; P$4 -1.05,0; P$5 -2.15,0; P$6 -3.25,0; P$7 -4.35,0; P$8 -5.45,0; P$13 -6.55,0 | hole 1: -4.4,-10.5; 3.05,-10.5
BGA289C80P17X17_1500X1500X100 = smd 0.35 x 0.35: A1 -6.4,6.4; A2 -5.6,6.4; A3 -4.8,6.4; A4 -4,6.4; A5 -3.2,6.4; A6 -2.4,6.4; A7 -1.6,6.4; A8 -0.8,6.4; A9 0,6.4; A10 0.8,6.4; A11 1.6,6.4; A12 2.4,6.4; A13 3.2,6.4; A14 4,6.4; A15 4.8,6.4; A16 5.6,6.4; A17 6.4,6.4; B1 -6.4,5.6; B2 -5.6,5.6; B3 -4.8,5.6; B4 -4,5.6; B5 -3.2,5.6; B6 -2.4,5.6; B7 -1.6,5.6; B8 -0.8,5.6; B9 0,5.6; B10 0.8,5.6; B11 1.6,5.6; B12 2.4,5.6; B13 3.2,5.6; B14 4,5.6; B15 4.8,5.6; B16 5.6,5.6; B17 6.4,5.6; C1 -6.4,4.8; C2 -5.6,4.8; C3 -4.8,4.8; C4 -4,4.8; C5 -3.2,4.8; C6 -2.4,4.8; C7 -1.6,4.8; C8 -0.8,4.8; C9 0,4.8; C10 0.8,4.8; C11 1.6,4.8; C12 2.4,4.8; C13 3.2,4.8; C14 4,4.8; C15 4.8,4.8; C16 5.6,4.8; C17 6.4,4.8; D1 -6.4,4; D2 -5.6,4; D3 -4.8,4; D4 -4,4; D5 -3.2,4; D6 -2.4,4; D7 -1.6,4; D8 -0.8,4; D9 0,4; D10 0.8,4; D11 1.6,4; D12 2.4,4; D13 3.2,4; D14 4,4; D15 4.8,4; D16 5.6,4; D17 6.4,4; E1 -6.4,3.2; E2 -5.6,3.2; E3 -4.8,3.2; E4 -4,3.2; E14 4,3.2; E15 4.8,3.2; E16 5.6,3.2; E17 6.4,3.2; F1 -6.4,2.4; F2 -5.6,2.4; F3 -4.8,2.4; F4 -4,2.4; F14 4,2.4; F15 4.8,2.4; F16 5.6,2.4; F17 6.4,2.4; G1 -6.4,1.6; G2 -5.6,1.6; G3 -4.8,1.6; G4 -4,1.6; G14 4,1.6; G15 4.8,1.6; G16 5.6,1.6; G17 6.4,1.6; H1 -6.4,0.8; H2 -5.6,0.8; H3 -4.8,0.8; H4 -4,0.8; H8 -0.8,0.8; H9 0,0.8; H10 0.8,0.8; H14 4,0.8; H15 4.8,0.8; H16 5.6,0.8; H17 6.4,0.8; J1 -6.4,0; J2 -5.6,0; J3 -4.8,0; J4 -4,0; J8 -0.8,0; J9 0,0; J10 0.8,0; J14 4,0; J15 4.8,0; J16 5.6,0; J17 6.4,0; K1 -6.4,-0.8; K2 -5.6,-0.8; K3 -4.8,-0.8; K4 -4,-0.8; K8 -0.8,-0.8; K9 0,-0.8; K10 0.8,-0.8; K14 4,-0.8; K15 4.8,-0.8; K16 5.6,-0.8; K17 6.4,-0.8; L1 -6.4,-1.6; L2 -5.6,-1.6; L3 -4.8,-1.6; L4 -4,-1.6; L14 4,-1.6; L15 4.8,-1.6; L16 5.6,-1.6; L17 6.4,-1.6; M1 -6.4,-2.4; M2 -5.6,-2.4; M3 -4.8,-2.4; M4 -4,-2.4; M14 4,-2.4; M15 4.8,-2.4; M16 5.6,-2.4; M17 6.4,-2.4; N1 -6.4,-3.2; N2 -5.6,-3.2; N3 -4.8,-3.2; N4 -4,-3.2; N14 4,-3.2; N15 4.8,-3.2; N16 5.6,-3.2; N17 6.4,-3.2; P1 -6.4,-4; P2 -5.6,-4; P3 -4.8,-4; P4 -4,-4; P5 -3.2,-4; P6 -2.4,-4; P7 -1.6,-4; P8 -0.8,-4; P9 0,-4; P10 0.8,-4; P11 1.6,-4; P12 2.4,-4; P13 3.2,-4; P14 4,-4; P15 4.8,-4; P16 5.6,-4; P17 6.4,-4; R1 -6.4,-4.8; R2 -5.6,-4.8; R3 -4.8,-4.8; R4 -4,-4.8; R5 -3.2,-4.8; R6 -2.4,-4.8; R7 -1.6,-4.8; R8 -0.8,-4.8; R9 0,-4.8; R10 0.8,-4.8; R11 1.6,-4.8; R12 2.4,-4.8; R13 3.2,-4.8; R14 4,-4.8; R15 4.8,-4.8; R16 5.6,-4.8; R17 6.4,-4.8; T1 -6.4,-5.6; T2 -5.6,-5.6; T3 -4.8,-5.6; T4 -4,-5.6; T5 -3.2,-5.6; T6 -2.4,-5.6; T7 -1.6,-5.6; T8 -0.8,-5.6; T9 0,-5.6; T10 0.8,-5.6; T11 1.6,-5.6; T12 2.4,-5.6; T13 3.2,-5.6; T14 4,-5.6; T15 4.8,-5.6; T16 5.6,-5.6; T17 6.4,-5.6; U1 -6.4,-6.4; U2 -5.6,-6.4; U3 -4.8,-6.4; U4 -4,-6.4; U5 -3.2,-6.4; U6 -2.4,-6.4; U7 -1.6,-6.4; U8 -0.8,-6.4; U9 0,-6.4; U10 0.8,-6.4; U11 1.6,-6.4; U12 2.4,-6.4; U13 3.2,-6.4; U14 4,-6.4; U15 4.8,-6.4; U16 5.6,-6.4; U17 6.4,-6.4
SOT95P280X100-5 = smd 1.116 x 0.589: 1 -1.242,0.95; 2 -1.242,0; 3 -1.242,-0.95; 4 1.242,-0.95; 5 1.242,0.95
TSSOP8 = smd 1.2 x 0.35: 1 -2.925,0.975; 2 -2.925,0.325; 3 -2.925,-0.325; 4 -2.925,-0.975; 5 2.925,-0.975; 6 2.925,-0.325; 7 2.925,0.325; 8 2.925,0.975
SOT95P280X110-6 = smd 1.259 x 0.609: 1 -1.228,0.95; 2 -1.228,0; 3 -1.228,-0.95; 4 1.228,-0.95; 5 1.228,0; 6 1.228,0.95
SOIC8_208MIL = smd 0.6 x 2.2: 1 -1.905,-3.315; 2 -0.635,-3.315; 3 0.635,-3.315; 4 1.905,-3.315; 5 1.905,3.315; 6 0.635,3.315; 7 -0.635,3.315; 8 -1.905,3.315
L3230M = smd 1.2 x 2.7: 1 -1.4,0; 2 1.4,0
L0402 = smd 0.5 x 0.6: 1 -0.5,0; 2 0.5,0
321015RGB = smd 0.5 x 0.8: 1 -0.415,0.4; 4 0.415,0.4 | smd 0.95 x 1.1: 2 -1.475,0; 3 1.475,0
3215 = smd 1.3 x 1.1: 1 -1.15,-0.9; 2 1.15,-0.9; 3 1.15,0.9; 4 -1.15,0.9
3215' = smd 1 x 1.8: 1 -1.25,0; 2 1.25,0
R0402 = smd 0.6 x 0.7: 1 -0.5,0; 2 0.5,0
R0603 = smd 0.8 x 1: 1 -0.75,0; 2 0.75,0
R0603' = smd 1 x 1.1: 1 -0.85,0; 2 0.85,0
SW_PTS840GMSMTRLFS = smd 1.4 x 1.05: 1 -1.9,0.725; 2 1.9,0.725; 3 -1.9,-0.725; 4 1.9,-0.725 | smd 1.1 x 0.5: 5 0,1.7 | drill 0.65 pad 0.7: P$1 -2,-0.8; P$2 2,-0.8 | hole 0.7: 0,-0.9; 0,0.9
MA18-2 = drill 1.016 octagon: 1 -21.59,-1.27; 2 -21.59,1.27; 3 -19.05,-1.27; 4 -19.05,1.27; 5 -16.51,-1.27; 6 -16.51,1.27; 7 -13.97,-1.27; 8 -13.97,1.27; 9 -11.43,-1.27; 10 -11.43,1.27; 11 -8.89,-1.27; 12 -8.89,1.27; 13 -6.35,-1.27; 14 -6.35,1.27; 15 -3.81,-1.27; 16 -3.81,1.27; 17 -1.27,-1.27; 18 -1.27,1.27; 19 1.27,-1.27; 20 1.27,1.27; 21 3.81,-1.27; 22 3.81,1.27; 23 6.35,-1.27; 24 6.35,1.27; 25 8.89,-1.27; 26 8.89,1.27; 27 11.43,-1.27; 28 11.43,1.27; 29 13.97,-1.27; 30 13.97,1.27; 31 16.51,-1.27; 32 16.51,1.27; 33 19.05,-1.27; 34 19.05,1.27; 35 21.59,-1.27; 36 21.59,1.27
MA05-2 = drill 1.016 octagon: 1 -5.08,-1.27; 2 -5.08,1.27; 3 -2.54,-1.27; 4 -2.54,1.27; 5 0,-1.27; 6 0,1.27; 7 2.54,-1.27; 8 2.54,1.27; 9 5.08,-1.27; 10 5.08,1.27
MA04-2 = drill 1.016 octagon: 1 -3.81,-1.27; 2 -3.81,1.27; 3 -1.27,-1.27; 4 -1.27,1.27; 5 1.27,-1.27; 6 1.27,1.27; 7 3.81,-1.27; 8 3.81,1.27
SOT23-BEC = smd 1 x 1.4: B -0.95,-1.1; C 0,1.1; E 0.95,-1.1
BGA81C80P9X9_800X800X120 = smd 0.4 x 0.4: A1 -3.2,3.2; A2 -2.4,3.2; A3 -1.6,3.2; A7 1.6,3.2; A8 2.4,3.2; A9 3.2,3.2; B1 -3.2,2.4; B2 -2.4,2.4; B3 -1.6,2.4; B7 1.6,2.4; B8 2.4,2.4; B9 3.2,2.4; C1 -3.2,1.6; C2 -2.4,1.6; C3 -1.6,1.6; C7 1.6,1.6; C8 2.4,1.6; C9 3.2,1.6; D1 -3.2,0.8; D2 -2.4,0.8; D3 -1.6,0.8; D7 1.6,0.8; D8 2.4,0.8; D9 3.2,0.8; E1 -3.2,0; E2 -2.4,0; E3 -1.6,0; E7 1.6,0; E8 2.4,0; E9 3.2,0; F1 -3.2,-0.8; F2 -2.4,-0.8; F3 -1.6,-0.8; F7 1.6,-0.8; F8 2.4,-0.8; F9 3.2,-0.8; G1 -3.2,-1.6; G2 -2.4,-1.6; G3 -1.6,-1.6; G7 1.6,-1.6; G8 2.4,-1.6; G9 3.2,-1.6; H1 -3.2,-2.4; H2 -2.4,-2.4; H3 -1.6,-2.4; H7 1.6,-2.4; H8 2.4,-2.4; H9 3.2,-2.4; J1 -3.2,-3.2; J2 -2.4,-3.2; J3 -1.6,-3.2; J7 1.6,-3.2; J8 2.4,-3.2; J9 3.2,-3.2

### Placement (x,y rotation side)
C1  26.5,10.1 270 top
C2  37.4,18.9 0 bottom
C3  35.5,19.8 270 bottom
C4  26.3,23.6 270 top
C9  33.15,14.75 90 bottom
C10  37.4,17.5 0 bottom
C11  55.5,13.3 0 top
C13  19.9,11.7 270 top
C14  43.1,19.5 270 top
C15  32.2,16.5 180 bottom
C16  30.6,26.1 180 top
C17  34.9,14.7 90 bottom
C18  43.1,21.3 270 top
C20  19.9,9.9 90 top
C21  46.8,31.1 270 top
C22  44.8,31.1 270 top
C25  44,28.8 90 top
C26  38.2,28.6 270 top
C27  24,12.6 270 top
C28  24,14.4 90 top
C29  55.6,9 0 top
C30  55.6,10.8 0 top
C31  55.6,12 0 top
C32  45.2,14.8 180 top
C33  45.2,13.7 180 top
C34  45.2,25.6 180 top
C35  55.6,20 0 top
C36  55.6,24.8 0 top
C37  55.6,23.4 0 top
C38  45.2,23.8 180 top
C39  55.6,26 0 top
C40  55.4,15.6 180 top
C41  67.8,33.8 0 top
C42  62.8,33.8 0 top
C43  69.4,38.35 90 top
C44  17.6,11.8 0 top
C45  7.4,33 90 top
C46  10.4,33 90 top
C47  12,33 90 top
C48  11,25.2 0 top
C49  9,25.2 180 top
C50  10,26.6 270 top
C51  16.4,9 270 top
C52  15.4,9 270 top
C53  69.4,34.8 270 top
C54  54.6,36.4 180 top
C55  54.6,38.6 180 top
C56  72.6,34.6 270 top
C57  58.9,34.9 0 top
C58  78.2,35.8 0 top
C59  78.2,34.4 0 top
C60  64.4,34.8 270 top
C61  64.4,38.35 90 top
C62  16.6,24.4 0 top
C63  8.6,19.2 270 top
CON1  1.5,30 270 top
CON2  14.6,14 270 top
IC1  34.8,17.4 180 top
IC3  17.6,13.8 180 top
IC4  9.4,30.2 180 top
IC5  71.6,37.6 270 top
IC6  16.4,29.6 180 top
IC7  58,37.6 270 top
L1  75.2,36.4 270 top
L2  62,37.6 270 top
L3  38.1,25.7 0 top
LED1  1,23.6 270 top
Q1  41.6,28.8 180 top
Q2  [3215']  25.4,13.4 90 top
R1  45.9,31.2 90 top
R2  55.6,10 0 top
R3  17.6,16 180 top
R4  17.6,10.8 0 top
R5  11.2,26.6 270 top
R6  8.8,26.6 270 top
R7  9.2,23.8 90 top
R8  10.8,23.8 90 top
R9  17.4,6.8 270 top
R10  18.4,6.8 270 top
R11  18.4,9 270 top
R12  17.4,9 270 top
R13  70.8,34.8 270 top
R14  5.8,33 90 top
R15  56.35,34.9 180 top
R16  78.2,37 180 top
R17  78.2,38.2 0 top
R18  60.8,34.9 0 top
R19  62.8,34.9 0 top
R20  3,25.2 180 top
R21  3,24 180 top
R22  3,22.8 180 top
R23  10.8,18.2 90 top
R24  8.2,17.8 270 top
R25  [R0603']  66.8,38.2 0 top
R26  [R0603']  66.8,35.4 180 top
R27  19.9,7.8 270 top
R28  21.8,33.4 180 top
R29  21.8,32.2 180 top
S1  56,1.6 0 top
S2  72.2,1.6 0 top
SV1  30,37 180 bottom
SV2  13.49,3 0 top
SV3  64.7,3 0 top
T1  10,20.8 180 top
U1  50.4,12.2 0 top
U2  50.4,23.2 0 top

### Tracks (layer width: path | path; a pad name or v marks a point on that pad's centre or on a via)
!MRST  (2 unrouted)
  Top 0.2: IC3.4 16.55,14.75 17.1,15.3 R3.2
!RST  (via drill 0.3)  (1 unrouted)
  Top 0.2: IC3.1 18.84,11.96 v19,11.8 19,11.7 R4.2
!WKUP  (via drill 0.3)  (1 unrouted)
  Top 0.2: S2.1 70.67,2.33 71.4,1.6 v73,1.6 73.72,2.33 S2.2
  Bottom 0.2: v73,1.6 70,1.6 68.9,0.5
+1V8  (via drill 0.4, 0.6)  (13 unrouted)
  Top 0.2: L2.2 61.3,35.5 R18.2 | 30.95,25.95 C16.1
  Top 0.6: C61.1 v64.4,36.6 | C60.1 v64.4,36.6 | L2.2 64,36.2 v64.4,36.6
  Route15 0.8: 66.4,37.28 65.04,37.28
  Route15 1: 65.04,37.28 64.4,36.64 v64.4,36.6 64.4,34.4
  other vias: 66.4,39.2 65.6,39.2 65.6,37.2 66.4,37.2
  pour Top (isolate 0.2, no thermals): 65.2,39.6 65.2,37 66.8,37 66.8,39.6
+3V3  (via drill 0.3, 0.4)  (20 unrouted)
  Top 0.2: R3.1 18.84,15.26 IC3.3 17.9,14.75 17.3,14.15 17.3,12.5 17.6,12.2 17.6,11.3 R4.1 v16.2,10.8 | LED1.2 0.63,24.7 v0.63,23.6 | R28.2 R29.2 v20.2,32.2
  Route15 1: v76.4,34 v75.2,34 v74.2,34 73,32.8 68,32.8 v66.4,34.4 | v66.4,34.4 66.4,36.18 | v66.4,34.4 66.4,33.8
  other vias: 66.4,36.4 65.6,36.4 65.6,34.4
  pour Route15 (isolate 0.6, no thermals): -2,-2 -2,42 47.4,42 47.4,-2
  pour Top (isolate 0.2, no thermals): 73.8,35.8 76.6,35.8 77.2,36.4 77.2,37.4 78,37.4 78,33.8 73.8,33.8
  pour Top (isolate 0.2, no thermals): 65.2,36.6 66.8,36.6 66.8,34 65.2,34
+5V  (via drill 0.6)  (2 unrouted)
  Top 0.6: C53.1 v69.4,36.6 69.4,37.6 69.3,37.5 C43.1 70.3,37.5 70.65,37.85 IC5.3 | IC7.3 57.05,38.25 v56.4,37.6 | C55.1 56.4,37.65 v56.4,37.6 | C54.1 55.45,36.65 v56.4,37.6
  Route2 1: v69.4,36.6 68.2,35.4 59.4,35.4 57.2,37.6 v56.4,37.6
ADDR0  (1 unrouted)
ADDR1  (1 unrouted)
ADDR2  (2 unrouted)
ADDR3  (2 unrouted)
ADDR4  (2 unrouted)
ADDR5  (2 unrouted)
ADDR6  (2 unrouted)
ADDR7  (2 unrouted)
ADDR8  (2 unrouted)
ADDR9  (2 unrouted)
ADDR10  (2 unrouted)
ADDR11  (2 unrouted)
ADDR13  (2 unrouted)
ADDR14  (2 unrouted)
ADDR16  (2 unrouted)
ADDR17  (2 unrouted)
BMS  (1 unrouted)
CAS  (2 unrouted)
CFIOR_NBS1_NWR1  (1 unrouted)
CFIOW_NBS3_NWR3  (1 unrouted)
DATA0  (1 unrouted)
DATA1  (1 unrouted)
DATA2  (1 unrouted)
DATA3  (1 unrouted)
DATA4  (1 unrouted)
DATA5  (1 unrouted)
DATA6  (1 unrouted)
DATA7  (1 unrouted)
DATA8  (1 unrouted)
DATA9  (1 unrouted)
DATA10  (1 unrouted)
DATA11  (1 unrouted)
DATA12  (1 unrouted)
DATA13  (1 unrouted)
DATA14  (1 unrouted)
DATA15  (1 unrouted)
DATA16  (1 unrouted)
DATA17  (1 unrouted)
DATA18  (1 unrouted)
DATA19  (1 unrouted)
DATA20  (1 unrouted)
DATA21  (1 unrouted)
DATA22  (1 unrouted)
DATA23  (1 unrouted)
DATA24  (1 unrouted)
DATA25  (1 unrouted)
DATA26  (1 unrouted)
DATA27  (1 unrouted)
DATA28  (1 unrouted)
DATA29  (1 unrouted)
DATA30  (1 unrouted)
DATA31  (1 unrouted)
GND  (via drill 0.3, 0.4, 0.6)  (97 unrouted)
  Top 0.2: C44.2 18,11.9 18,13.6 18.2,13.8 IC3.2 | 26.45,23.25 C4.2 | C13.2 C20.2 | R17.2 78.7,38.5 78,39.2 v76.4,39.2 | S2.5 73.1,3.3 v73.4,3.6
  Top 0.3: 68.3,33.7 C41.2
  Top 0.4: 79,34.35 C59.2 79.05,34.45 | C58.2 78.4,35.15 v78.4,35.1 79.05,34.45 | 79.2,34.3 79.05,34.45 | C53.2 68.45,33.95 C41.2 | 64.8,33.55 C60.2 63.45,33.95 C42.2 R19.2 | C61.2 v64.4,38.4
  Top 0.6: CON2.GND2 6.25,21.75 v6.4,21.6 | CON2.GND3 6.25,6.25 v6.4,6.4 | CON2.GND4 12.85,7.15 v12.8,7.2 | CON2.GND1 12.75,21.75 v12.6,21.6 | CON2.P$6 13.25,17.25 v13.2,17.2 | C43.2 v69.4,38.4 | IC7.1 59.77,38.83 v59.8,38.8 | C54.2 53.75,37.35 | 53.75,37.35 v53.8,37.4 | C55.2 53.75,37.35
  other vias: 74,39.2 75.2,39.2
  pour Route2 (isolate 0.6, no thermals): -1,-1 -1,41 81,41 81,-1
  pour Top (isolate 0.2, no thermals): 72.4,39.6 72.4,38.4 73.4,38.4 73.8,38.8 77,38.8 77,39.6
HDMA  (1 unrouted)
HDPA  (1 unrouted)
HSE_IN  (2 unrouted)
HSE_OUT  (2 unrouted)
I2C_SCL  (2 unrouted)
  Top 0.2: 22.35,29.95 22.6,30.2 22.6,31.9 R29.1
I2C_SDA  (2 unrouted)
LSE_IN  (2 unrouted)
LSE_OUT  (2 unrouted)
MCCDA  (1 unrouted)
MCCDT  (1 unrouted)
MCCK  (1 unrouted)
MCDA0  (1 unrouted)
MCDA1  (1 unrouted)
MCDA2  (1 unrouted)
MCDA3  (1 unrouted)
N$1  (1 unrouted)
N$3
  Top 0.2: 73.6,37.6 73.6,37 73.3,36.7 73.3,34.8 C56.2
  Top 0.6: IC5.2 71.6,38 72,37.6 73.6,37.6 75,37.6 L1.1
N$4  (1 unrouted)
N$8
  Top 0.2: 59.8,37.6 59.8,35.8 59.4,35.4 C57.2
  Top 0.6: IC7.2 58,38 58.4,37.6 59.8,37.6 60.4,37.6 61.8,39 L2.1
N$9
  Top 0.2: LED1.1 2.5,25.11 R20.2
N$10
  Top 0.2: C56.1 72.6,36.32 IC5.6
N$11
  Top 0.154: C57.1 58.95,35.45 IC7.6
N$13  (2 unrouted)
N$14
  Top 0.2: LED1.4 1.69,23.18 R21.2
N$15
  Top 0.2: IC7.4 56.85,36.17 R15.1
N$17
  Top 0.2: C44.1 16.36,12.54 IC3.5
N$18  (1 unrouted)
N$19  (2 unrouted)
N$20  (1 unrouted)
N$21
  Top 0.154: R19.1 61.65,34.25 60.95,34.25 R18.1 59.7,34.3 56.45,34.3 R15.2
N$22  (via drill 0.3)
  Top 0.2: R16.1 78.7,37.15 77.72,38.12 | 77.72,38.12 77.7,38.15 R17.1 | R13.2 71.7,34.3 v71.8,34.4 | v77,38.4 77.45,38.4 77.72,38.12
  Bottom 0.2: v71.8,34.4 75.8,38.4 v77,38.4
N$23
  Top 0.2: LED1.3 1.82,22.12 R22.2
N$28  (2 unrouted)
NRST  (1 unrouted)
PLLRCA  (2 unrouted)
RAS  (2 unrouted)
REG_EN  (via drill 0.3)
  Top 0.2: IC5.5 71.6,35.4 v71.8,35.2 | IC7.5 58,35.53 57.6,35.13 v57.6,34.9
  Bottom 0.2: v71.8,35.2 57.9,35.2 v57.6,34.9
SDA10  (2 unrouted)
SDCK  (2 unrouted)
SDCKE  (2 unrouted)
SDCS  (3 unrouted)
SDWE  (2 unrouted)
SPI_CLK  (2 unrouted)
SPI_CSB  (1 unrouted)
SPI_MISO  (2 unrouted)
SPI_MOSI  (2 unrouted)
UART_RXD0  (1 unrouted)
UART_RXD1  (1 unrouted)
  Bottom 0.2: SV1.16 26.59,35.33
UART_RXD2  (1 unrouted)
UART_TXD0  (1 unrouted)
UART_TXD1  (1 unrouted)
UART_TXD2  (1 unrouted)
USB_C_DM  (2 unrouted)
USB_C_DP  (3 unrouted)
USB_DP_PUP  (1 unrouted)
USB_VCC  (2 unrouted)
USBC_DM  (2 unrouted)
USBC_DP  (2 unrouted)
USBC_ID  (1 unrouted)
VDDBU  (2 unrouted)
VDDRAM  (via drill 0.3, 0.4)  (34 unrouted)
  Top 0.3: 45.6,14.9 C32.1 | 45.6,13.8 C33.1 | C41.1 67.2,33.7 | 62.4,33.7 C42.1 62.25,33.75 v61.2,33.75
  other vias: 68.2,36.8 67.4,36.8 67.4,39.2 68.2,39.2
  pour Route15 (isolate 0.6): 48,42 82,42 82,-2 48,-2
  pour Top (isolate 0.2, no thermals): 67.2,39.6 67.2,34.6 68.4,34.6 68.4,39.6
VEXT  (2 unrouted)

### Text on the board
tPlace: VDRD 2019